# EAGLE design EEG_cap_v3 (EAGLE 9.6.2)

## Sheet 1 of 4
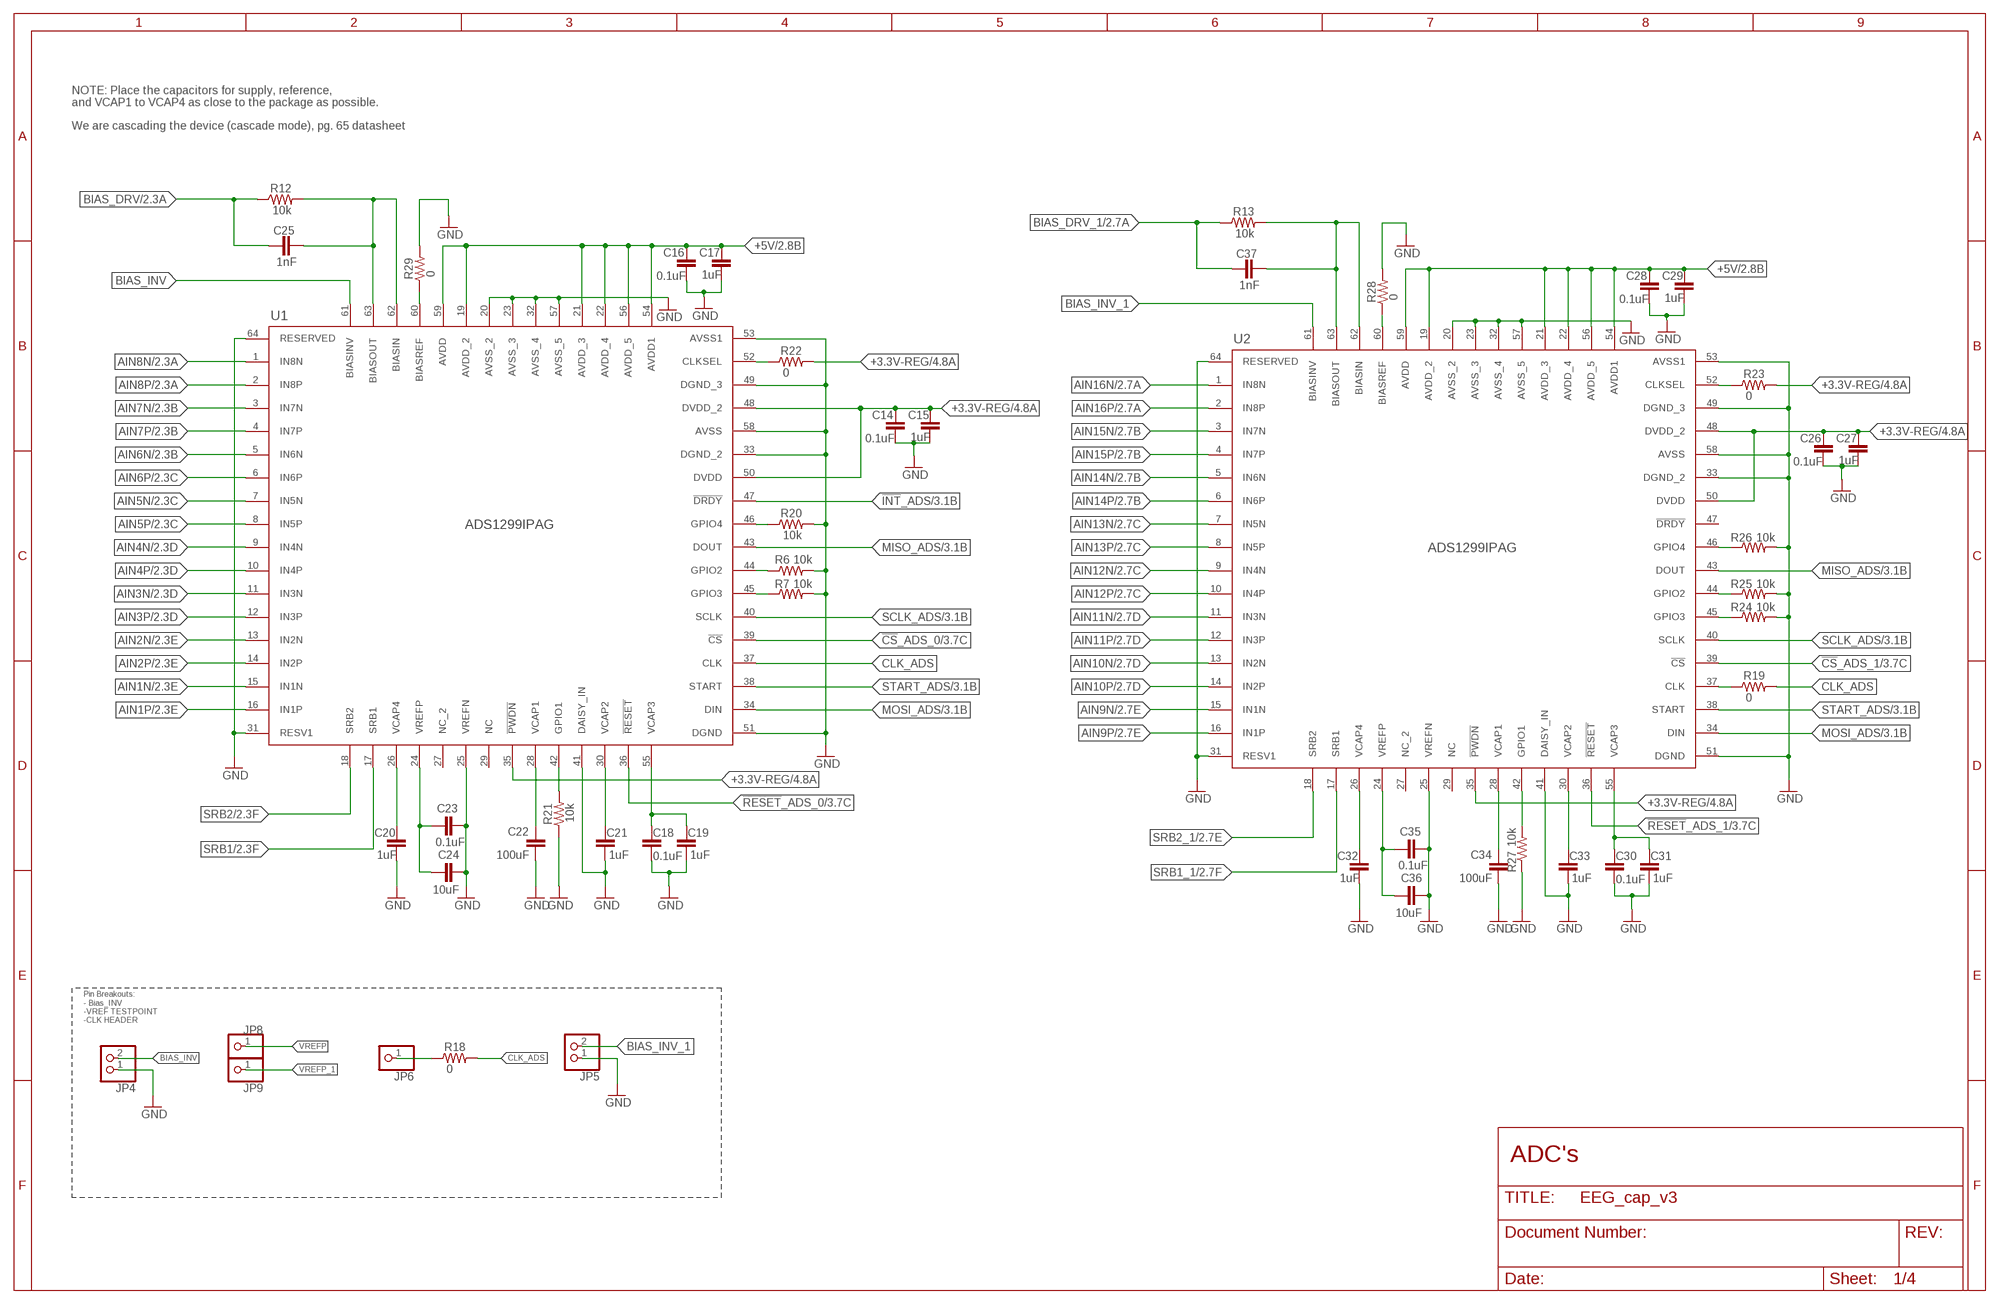
[diagram p0: schematic, sheet 1]

### Parts
C14  0.1uF  C-EUC0603  [C0603]
C15  1uF  C-EUC0603  [C0603]
C16  0.1uF  C-EUC0603  [C0603]
C17  1uF  C-EUC0603  [C0603]
C18  0.1uF  C-EUC0603  [C0603]
C19  1uF  C-EUC0603  [C0603]
C20  1uF  C-EUC0603  [C0603]
C21  1uF  C-EUC0603  [C0603]
C22  100uF  C-EUC1210  [C1210]
C23  0.1uF  C-EUC0603  [C0603]
C24  10uF  C-EUC0805  [C0805]
C25  1nF  C-EUC0603  [C0603]
C26  0.1uF  C-EUC0603  [C0603]
C27  1uF  C-EUC0603  [C0603]
C28  0.1uF  C-EUC0603  [C0603]
C29  1uF  C-EUC0603  [C0603]
C30  0.1uF  C-EUC0603  [C0603]
C31  1uF  C-EUC0603  [C0603]
C32  1uF  C-EUC0603  [C0603]
C33  1uF  C-EUC0603  [C0603]
C34  100uF  C-EUC1210  [C1210]
C35  0.1uF  C-EUC0603  [C0603]
C36  10uF  C-EUC0805  [C0805]
C37  1nF  C-EUC0603  [C0603]
JP4  PINHD-1X2  [1X02]
JP5  PINHD-1X2  [1X02]
JP6  PINHD-1X1  [1X01]
JP8  PINHD-1X1  [1X01]
JP9  PINHD-1X1  [1X01]
R6  10k  R-US_R0805  [R0805]
R7  10k  R-US_R0805  [R0805]
R12  10k  R-US_R0805  [R0805]
R13  10k  R-US_R0805  [R0805]
R18  0  R-US_R0805  [R0805]
R19  0  R-US_R0805  [R0805]
R20  10k  R-US_R0805  [R0805]
R21  10k  R-US_R0805  [R0805]
R22  0  R-US_R0805  [R0805]
R23  0  R-US_R0805  [R0805]
R24  10k  R-US_R0805  [R0805]
R25  10k  R-US_R0805  [R0805]
R26  10k  R-US_R0805  [R0805]
R27  10k  R-US_R0805  [R0805]
R28  0  R-US_R0805  [R0805]
R29  0  R-US_R0805  [R0805]
U1  ADS1299IPAG  [PAG64_TEX]
U2  ADS1299IPAG  [PAG64_TEX]

### Nets
!CS!_ADS_0: U1.39(!CS) ; also sheet 3
!CS!_ADS_1: U2.39(!CS) ; also sheet 3
!INT!_ADS: U1.47(!DRDY) ; also sheet 3
!RESET!_ADS_0: U1.36(!RESET) ; also sheet 3
!RESET!_ADS_1: U2.36(!RESET) ; also sheet 3
+3.3V-REG: C14.1 C15.1 C26.1 C27.1 R22.2 R23.2 U1.35(!PWDN) U1.48(DVDD_2) U1.50(DVDD) U2.35(!PWDN) U2.48(DVDD_2) U2.50(DVDD) ; also sheet 4
+5V: C16.1 C17.1 C28.1 C29.1 U1.19(AVDD_2) U1.21(AVDD_3) U1.22(AVDD_4) U1.54(AVDD1) U1.56(AVDD_5) U1.59(AVDD) U2.19(AVDD_2) U2.21(AVDD_3) U2.22(AVDD_4) U2.54(AVDD1) U2.56(AVDD_5) U2.59(AVDD) ; also sheet 2,3,4
AIN1N: U1.15(IN1N) ; also sheet 2
AIN1P: U1.16(IN1P) ; also sheet 2
AIN2N: U1.13(IN2N) ; also sheet 2
AIN2P: U1.14(IN2P) ; also sheet 2
AIN3N: U1.11(IN3N) ; also sheet 2
AIN3P: U1.12(IN3P) ; also sheet 2
AIN4N: U1.9(IN4N) ; also sheet 2
AIN4P: U1.10(IN4P) ; also sheet 2
AIN5N: U1.7(IN5N) ; also sheet 2
AIN5P: U1.8(IN5P) ; also sheet 2
AIN6N: U1.5(IN6N) ; also sheet 2
AIN6P: U1.6(IN6P) ; also sheet 2
AIN7N: U1.3(IN7N) ; also sheet 2
AIN7P: U1.4(IN7P) ; also sheet 2
AIN8N: U1.1(IN8N) ; also sheet 2
AIN8P: U1.2(IN8P) ; also sheet 2
AIN9N: U2.15(IN1N) ; also sheet 2
AIN9P: U2.16(IN1P) ; also sheet 2
AIN10N: U2.13(IN2N) ; also sheet 2
AIN10P: U2.14(IN2P) ; also sheet 2
AIN11N: U2.11(IN3N) ; also sheet 2
AIN11P: U2.12(IN3P) ; also sheet 2
AIN12N: U2.9(IN4N) ; also sheet 2
AIN12P: U2.10(IN4P) ; also sheet 2
AIN13N: U2.7(IN5N) ; also sheet 2
AIN13P: U2.8(IN5P) ; also sheet 2
AIN14N: U2.5(IN6N) ; also sheet 2
AIN14P: U2.6(IN6P) ; also sheet 2
AIN15N: U2.3(IN7N) ; also sheet 2
AIN15P: U2.4(IN7P) ; also sheet 2
AIN16N: U2.1(IN8N) ; also sheet 2
AIN16P: U2.2(IN8P) ; also sheet 2
BIAS1_IN: C37.2 R13.2 U2.62(BIASIN) U2.63(BIASOUT)
BIAS_DRV: C25.1 R12.1 ; also sheet 2
BIAS_DRV_1: C37.1 R13.1 ; also sheet 2
BIAS_IN: C25.2 R12.2 U1.62(BIASIN) U1.63(BIASOUT)
BIAS_INV: JP4.2 U1.61(BIASINV)
BIAS_INV_1: JP5.2 U2.61(BIASINV)
BIAS_REF: R29.1 U1.60(BIASREF)
BIAS_REF_1: R28.1 U2.60(BIASREF)
CLK: R19.1 U2.37(CLK)
CLK_ADS: R18.2 R19.2 U1.37(CLK)
CLK_HDR: JP6.1 R18.1
CLKSEL_0: R22.1 U1.52(CLKSEL)
CLKSEL_1: R23.1 U2.52(CLKSEL)
GND: C14.2 C15.2 C16.2 C17.2 C18.2 C19.2 C20.2 C21.2 C22.2 C23.2 C24.2 C26.2 C27.2 C28.2 C29.2 C30.2 C31.2 C32.2 C33.2 C34.2 C35.2 C36.2 JP4.1 JP5.1 R6.2 R7.2 R20.2 R21.1 R24.2 R25.2 R26.2 R27.1 R28.2 R29.2 U1.20(AVSS_2) U1.23(AVSS_3) U1.25(VREFN) U1.31(RESV1) U1.32(AVSS_4) U1.33(DGND_2) U1.41(DAISY_IN) U1.49(DGND_3) U1.51(DGND) U1.53(AVSS1) U1.57(AVSS_5) U1.58(AVSS) U1.64(RESERVED) U2.20(AVSS_2) U2.23(AVSS_3) U2.25(VREFN) U2.31(RESV1) U2.32(AVSS_4) U2.33(DGND_2) U2.41(DAISY_IN) U2.49(DGND_3) U2.51(DGND) U2.53(AVSS1) U2.57(AVSS_5) U2.58(AVSS) U2.64(RESERVED) ; also sheet 2,3,4
MISO_ADS: U1.43(DOUT) U2.43(DOUT) ; also sheet 3
MOSI_ADS: U1.34(DIN) U2.34(DIN) ; also sheet 3
N$1: R21.2 U1.42(GPIO1)
N$2: R7.1 U1.45(GPIO3)
N$3: R6.1 U1.44(GPIO2)
N$4: R20.1 U1.46(GPIO4)
N$5: R24.1 U2.45(GPIO3)
N$6: R25.1 U2.44(GPIO2)
N$7: R26.1 U2.46(GPIO4)
N$8: R27.2 U2.42(GPIO1)
SCLK_ADS: U1.40(SCLK) U2.40(SCLK) ; also sheet 3
SRB1: U1.17(SRB1) ; also sheet 2
SRB1_1: U2.17(SRB1) ; also sheet 2
SRB2: U1.18(SRB2) ; also sheet 2
SRB2_1: U2.18(SRB2) ; also sheet 2
START_ADS: U1.38(START) U2.38(START) ; also sheet 3
VCAP1: C22.1 U1.28(VCAP1)
VCAP1_1: C34.1 U2.28(VCAP1)
VCAP2: C21.1 U1.30(VCAP2)
VCAP2_1: C33.1 U2.30(VCAP2)
VCAP3: C18.1 C19.1 U1.55(VCAP3)
VCAP3_1: C30.1 C31.1 U2.55(VCAP3)
VCAP4: C20.1 U1.26(VCAP4)
VCAP6: C32.1 U2.26(VCAP4)
VREFP: C23.1 C24.1 JP8.1 U1.24(VREFP)
VREFP_1: C35.1 C36.1 JP9.1 U2.24(VREFP)
Unconnected: U1.27(NC_2) U1.29(NC) U2.27(NC_2) U2.29(NC) U2.47(!DRDY)

### Notes on the sheet
- NOTE: Place the capacitors for supply, reference,
  and VCAP1 to VCAP4 as close to the package as possible.
- We are cascading the device (cascade mode), pg. 65 datasheet
- Pin Breakouts: 
  - Bias_INV
  -VREF TESTPOINT
  -CLK HEADER
- ADC's

## Sheet 2 of 4
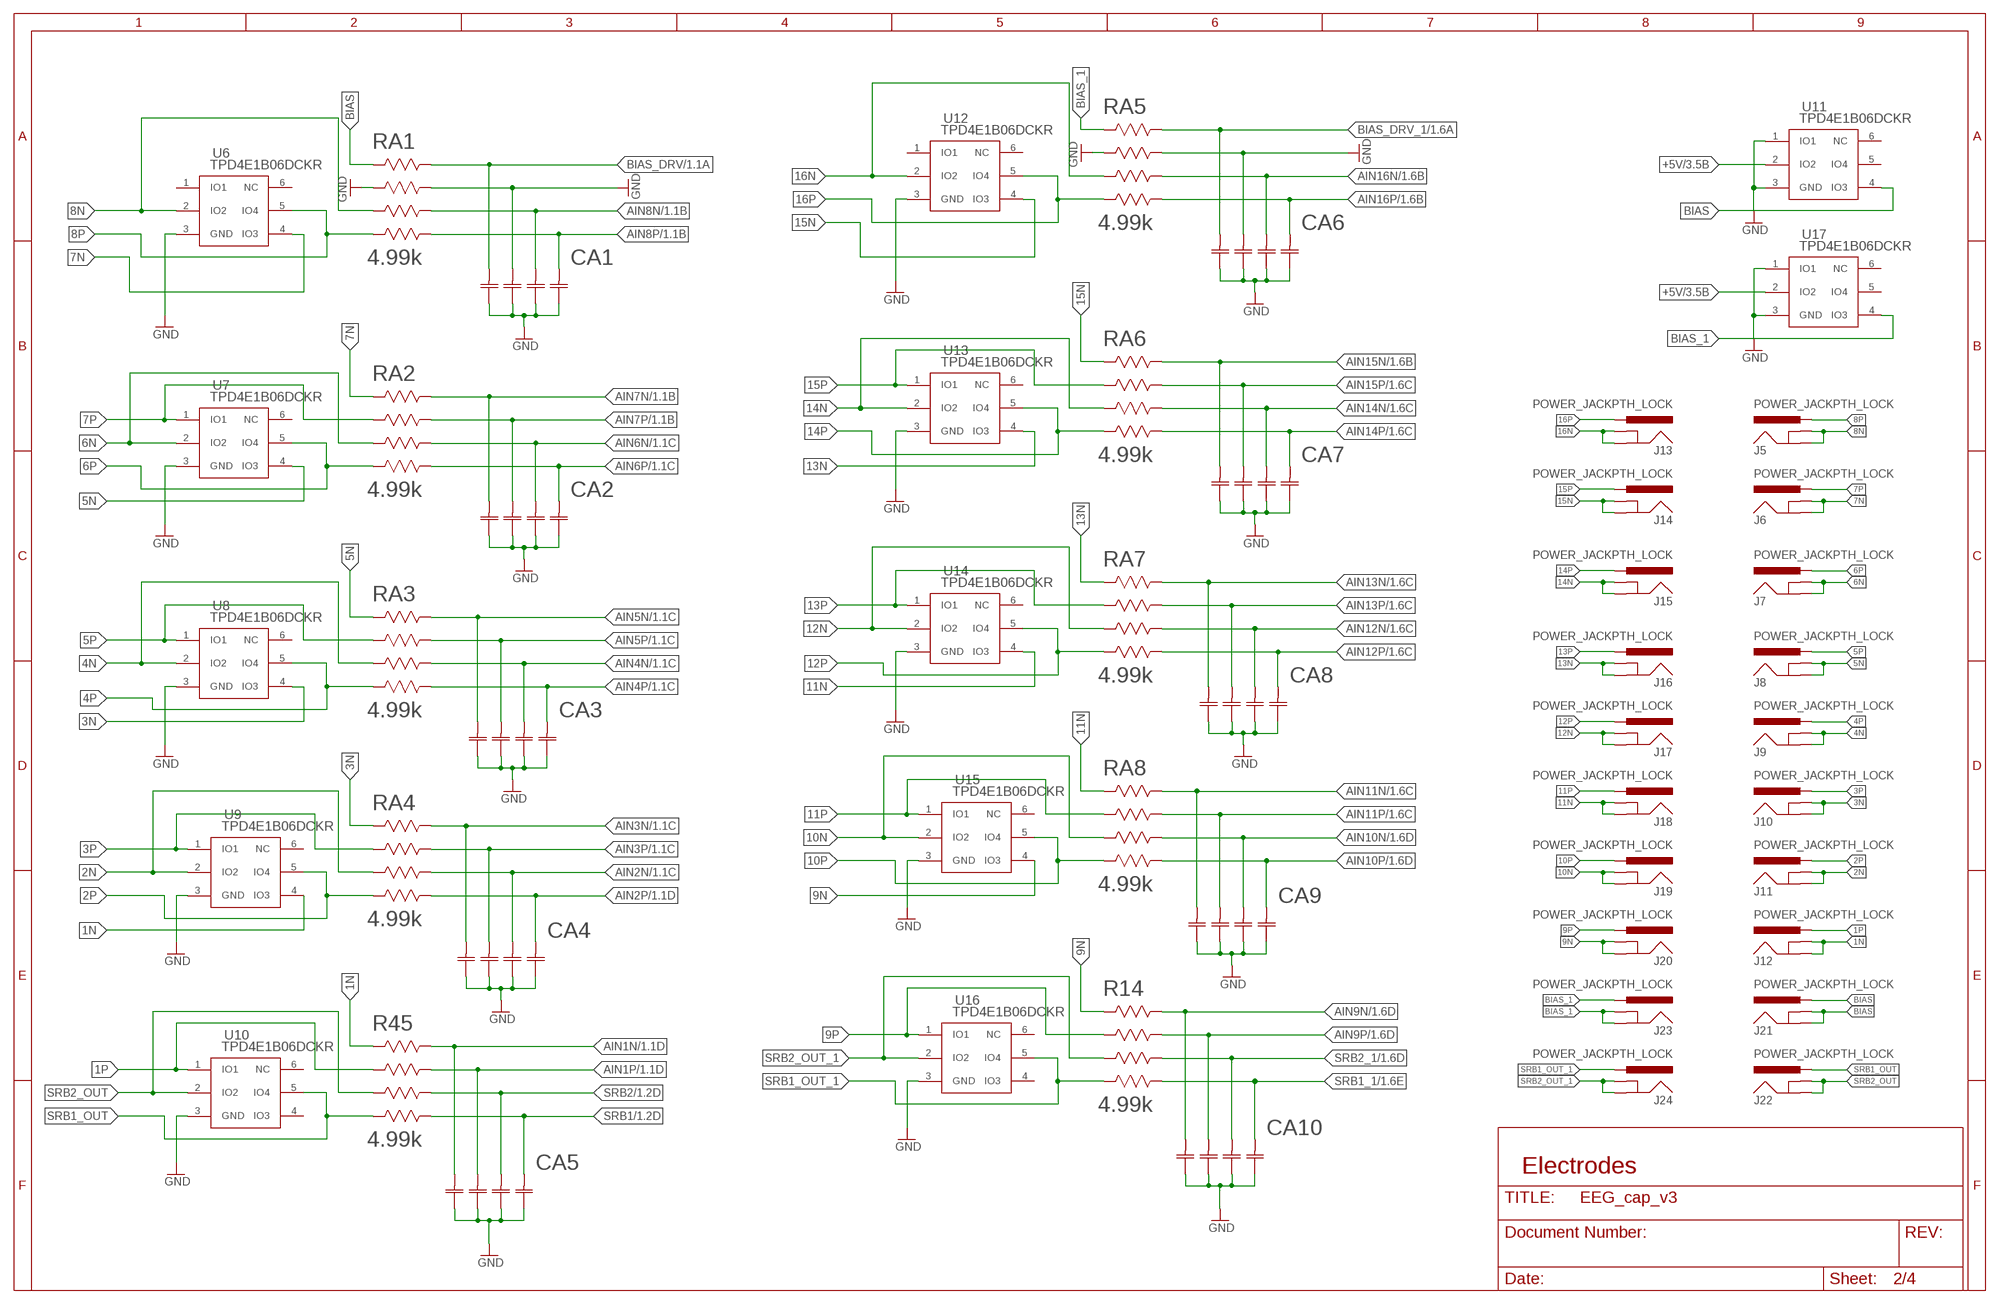
[diagram p1: schematic, sheet 2]

### Parts
CA1  4.7nF  CAP_ARRAY  [CAP_CA0612_3P2X1P6_YAG]
CA2  4.7nF  CAP_ARRAY  [CAP_CA0612_3P2X1P6_YAG]
CA3  4.7nF  CAP_ARRAY  [CAP_CA0612_3P2X1P6_YAG]
CA4  4.7nF  CAP_ARRAY  [CAP_CA0612_3P2X1P6_YAG]
CA5  4.7nF  CAP_ARRAY  [CAP_CA0612_3P2X1P6_YAG]
CA6  4.7nF  CAP_ARRAY  [CAP_CA0612_3P2X1P6_YAG]
CA7  4.7nF  CAP_ARRAY  [CAP_CA0612_3P2X1P6_YAG]
CA8  4.7nF  CAP_ARRAY  [CAP_CA0612_3P2X1P6_YAG]
CA9  4.7nF  CAP_ARRAY  [CAP_CA0612_3P2X1P6_YAG]
CA10  4.7nF  CAP_ARRAY  [CAP_CA0612_3P2X1P6_YAG]
J5  POWER_JACKPTH_LOCK  [POWER_JACK_PTH_LOCK]
J6  POWER_JACKPTH_LOCK  [POWER_JACK_PTH_LOCK]
J7  POWER_JACKPTH_LOCK  [POWER_JACK_PTH_LOCK]
J8  POWER_JACKPTH_LOCK  [POWER_JACK_PTH_LOCK]
J9  POWER_JACKPTH_LOCK  [POWER_JACK_PTH_LOCK]
J10  POWER_JACKPTH_LOCK  [POWER_JACK_PTH_LOCK]
J11  POWER_JACKPTH_LOCK  [POWER_JACK_PTH_LOCK]
J12  POWER_JACKPTH_LOCK  [POWER_JACK_PTH_LOCK]
J13  POWER_JACKPTH_LOCK  [POWER_JACK_PTH_LOCK]
J14  POWER_JACKPTH_LOCK  [POWER_JACK_PTH_LOCK]
J15  POWER_JACKPTH_LOCK  [POWER_JACK_PTH_LOCK]
J16  POWER_JACKPTH_LOCK  [POWER_JACK_PTH_LOCK]
J17  POWER_JACKPTH_LOCK  [POWER_JACK_PTH_LOCK]
J18  POWER_JACKPTH_LOCK  [POWER_JACK_PTH_LOCK]
J19  POWER_JACKPTH_LOCK  [POWER_JACK_PTH_LOCK]
J20  POWER_JACKPTH_LOCK  [POWER_JACK_PTH_LOCK]
J21  POWER_JACKPTH_LOCK  [POWER_JACK_PTH_LOCK]
J22  POWER_JACKPTH_LOCK  [POWER_JACK_PTH_LOCK]
J23  POWER_JACKPTH_LOCK  [POWER_JACK_PTH_LOCK]
J24  POWER_JACKPTH_LOCK  [POWER_JACK_PTH_LOCK]
R14  4.99k  CAT16-220J4LF  [BO_CAT16]
R45  4.99k  CAT16-220J4LF  [BO_CAT16]
RA1  4.99k  CAT16-220J4LF  [BO_CAT16]
RA2  4.99k  CAT16-220J4LF  [BO_CAT16]
RA3  4.99k  CAT16-220J4LF  [BO_CAT16]
RA4  4.99k  CAT16-220J4LF  [BO_CAT16]
RA5  4.99k  CAT16-220J4LF  [BO_CAT16]
RA6  4.99k  CAT16-220J4LF  [BO_CAT16]
RA7  4.99k  CAT16-220J4LF  [BO_CAT16]
RA8  4.99k  CAT16-220J4LF  [BO_CAT16]
U6  TPD4E1B06DCKR  [DCK6_TEX]
U7  TPD4E1B06DCKR  [DCK6_TEX]
U8  TPD4E1B06DCKR  [DCK6_TEX]
U9  TPD4E1B06DCKR  [DCK6_TEX]
U10  TPD4E1B06DCKR  [DCK6_TEX]
U11  TPD4E1B06DCKR  [DCK6_TEX]
U12  TPD4E1B06DCKR  [DCK6_TEX]
U13  TPD4E1B06DCKR  [DCK6_TEX]
U14  TPD4E1B06DCKR  [DCK6_TEX]
U15  TPD4E1B06DCKR  [DCK6_TEX]
U16  TPD4E1B06DCKR  [DCK6_TEX]
U17  TPD4E1B06DCKR  [DCK6_TEX]

### Nets
1N: J12.GND J12.GNDBREAK R45.1 U9.4(IO3)
1P: J12.PWR R45.2 U10.1(IO1)
2N: J11.GND J11.GNDBREAK RA4.3 U9.2(IO2)
2P: J11.PWR RA4.4 U9.5(IO4)
3N: J10.GND J10.GNDBREAK RA4.1 U8.4(IO3)
3P: J10.PWR RA4.2 U9.1(IO1)
4N: J9.GND J9.GNDBREAK RA3.3 U8.2(IO2)
4P: J9.PWR RA3.4 U8.5(IO4)
5N: J8.GND J8.GNDBREAK RA3.1 U7.4(IO3)
5P: J8.PWR RA3.2 U8.1(IO1)
6N: J7.GND J7.GNDBREAK RA2.3 U7.2(IO2)
6P: J7.PWR RA2.4 U7.5(IO4)
7N: J6.GND J6.GNDBREAK RA2.1 U6.4(IO3)
7P: J6.PWR RA2.2 U7.1(IO1)
8N: J5.GND J5.GNDBREAK RA1.3 U6.2(IO2)
8P: J5.PWR RA1.4 U6.5(IO4)
9N: J20.GND J20.GNDBREAK R14.1 U15.4(IO3)
9P: J20.PWR R14.2 U16.1(IO1)
10N: J19.GND J19.GNDBREAK RA8.3 U15.2(IO2)
10P: J19.PWR RA8.4 U15.5(IO4)
11N: J18.GND J18.GNDBREAK RA8.1 U14.4(IO3)
11P: J18.PWR RA8.2 U15.1(IO1)
12N: J17.GND J17.GNDBREAK RA7.3 U14.2(IO2)
12P: J17.PWR RA7.4 U14.5(IO4)
13N: J16.GND J16.GNDBREAK RA7.1 U13.4(IO3)
13P: J16.PWR RA7.2 U14.1(IO1)
14N: J15.GND J15.GNDBREAK RA6.3 U13.2(IO2)
14P: J15.PWR RA6.4 U13.5(IO4)
15N: J14.GND J14.GNDBREAK RA6.1 U12.4(IO3)
15P: J14.PWR RA6.2 U13.1(IO1)
16N: J13.GND J13.GNDBREAK RA5.3 U12.2(IO2)
16P: J13.PWR RA5.4 U12.5(IO4)
+5V: U11.2(IO2) U17.2(IO2) ; also sheet 1,3,4
AIN1N: CA5.8 R45.8 ; also sheet 1
AIN1P: CA5.7 R45.7 ; also sheet 1
AIN2N: CA4.6 RA4.6 ; also sheet 1
AIN2P: CA4.5 RA4.5 ; also sheet 1
AIN3N: CA4.8 RA4.8 ; also sheet 1
AIN3P: CA4.7 RA4.7 ; also sheet 1
AIN4N: CA3.6 RA3.6 ; also sheet 1
AIN4P: CA3.5 RA3.5 ; also sheet 1
AIN5N: CA3.8 RA3.8 ; also sheet 1
AIN5P: CA3.7 RA3.7 ; also sheet 1
AIN6N: CA2.6 RA2.6 ; also sheet 1
AIN6P: CA2.5 RA2.5 ; also sheet 1
AIN7N: CA2.8 RA2.8 ; also sheet 1
AIN7P: CA2.7 RA2.7 ; also sheet 1
AIN8N: CA1.6 RA1.6 ; also sheet 1
AIN8P: CA1.5 RA1.5 ; also sheet 1
AIN9N: CA10.8 R14.8 ; also sheet 1
AIN9P: CA10.7 R14.7 ; also sheet 1
AIN10N: CA9.6 RA8.6 ; also sheet 1
AIN10P: CA9.5 RA8.5 ; also sheet 1
AIN11N: CA9.8 RA8.8 ; also sheet 1
AIN11P: CA9.7 RA8.7 ; also sheet 1
AIN12N: CA8.6 RA7.6 ; also sheet 1
AIN12P: CA8.5 RA7.5 ; also sheet 1
AIN13N: CA8.8 RA7.8 ; also sheet 1
AIN13P: CA8.7 RA7.7 ; also sheet 1
AIN14N: CA7.6 RA6.6 ; also sheet 1
AIN14P: CA7.5 RA6.5 ; also sheet 1
AIN15N: CA7.8 RA6.8 ; also sheet 1
AIN15P: CA7.7 RA6.7 ; also sheet 1
AIN16N: CA6.6 RA5.6 ; also sheet 1
AIN16P: CA6.5 RA5.5 ; also sheet 1
BIAS: J21.GND J21.GNDBREAK J21.PWR RA1.1 U11.4(IO3)
BIAS_1: J23.GND J23.GNDBREAK J23.PWR RA5.1 U17.4(IO3)
BIAS_DRV: CA1.8 RA1.8 ; also sheet 1
BIAS_DRV_1: CA6.8 RA5.8 ; also sheet 1
GND: CA1.1 CA1.2 CA1.3 CA1.4 CA1.7 CA2.1 CA2.2 CA2.3 CA2.4 CA3.1 CA3.2 CA3.3 CA3.4 CA4.1 CA4.2 CA4.3 CA4.4 CA5.1 CA5.2 CA5.3 CA5.4 CA6.1 CA6.2 CA6.3 CA6.4 CA6.7 CA7.1 CA7.2 CA7.3 CA7.4 CA8.1 CA8.2 CA8.3 CA8.4 CA9.1 CA9.2 CA9.3 CA9.4 CA10.1 CA10.2 CA10.3 CA10.4 RA1.2 RA1.7 RA5.2 RA5.7 U6.3(GND) U7.3(GND) U8.3(GND) U9.3(GND) U10.3(GND) U11.1(IO1) U11.3(GND) U12.3(GND) U13.3(GND) U14.3(GND) U15.3(GND) U16.3(GND) U17.1(IO1) U17.3(GND) ; also sheet 1,3,4
SRB1: CA5.5 R45.5 ; also sheet 1
SRB1_1: CA10.5 R14.5 ; also sheet 1
SRB1_OUT: J22.PWR R45.4 U10.5(IO4)
SRB1_OUT_1: J24.PWR R14.4 U16.5(IO4)
SRB2: CA5.6 R45.6 ; also sheet 1
SRB2_1: CA10.6 R14.6 ; also sheet 1
SRB2_OUT: J22.GND J22.GNDBREAK R45.3 U10.2(IO2)
SRB2_OUT_1: J24.GND J24.GNDBREAK R14.3 U16.2(IO2)
Unconnected: U6.1(IO1) U6.6(NC) U7.6(NC) U8.6(NC) U9.6(NC) U10.4(IO3) U10.6(NC) U11.5(IO4) U11.6(NC) U12.1(IO1) U12.6(NC) U13.6(NC) U14.6(NC) U15.6(NC) U16.4(IO3) U16.6(NC) U17.5(IO4) U17.6(NC)

### Notes on the sheet
- Electrodes

## Sheet 3 of 4
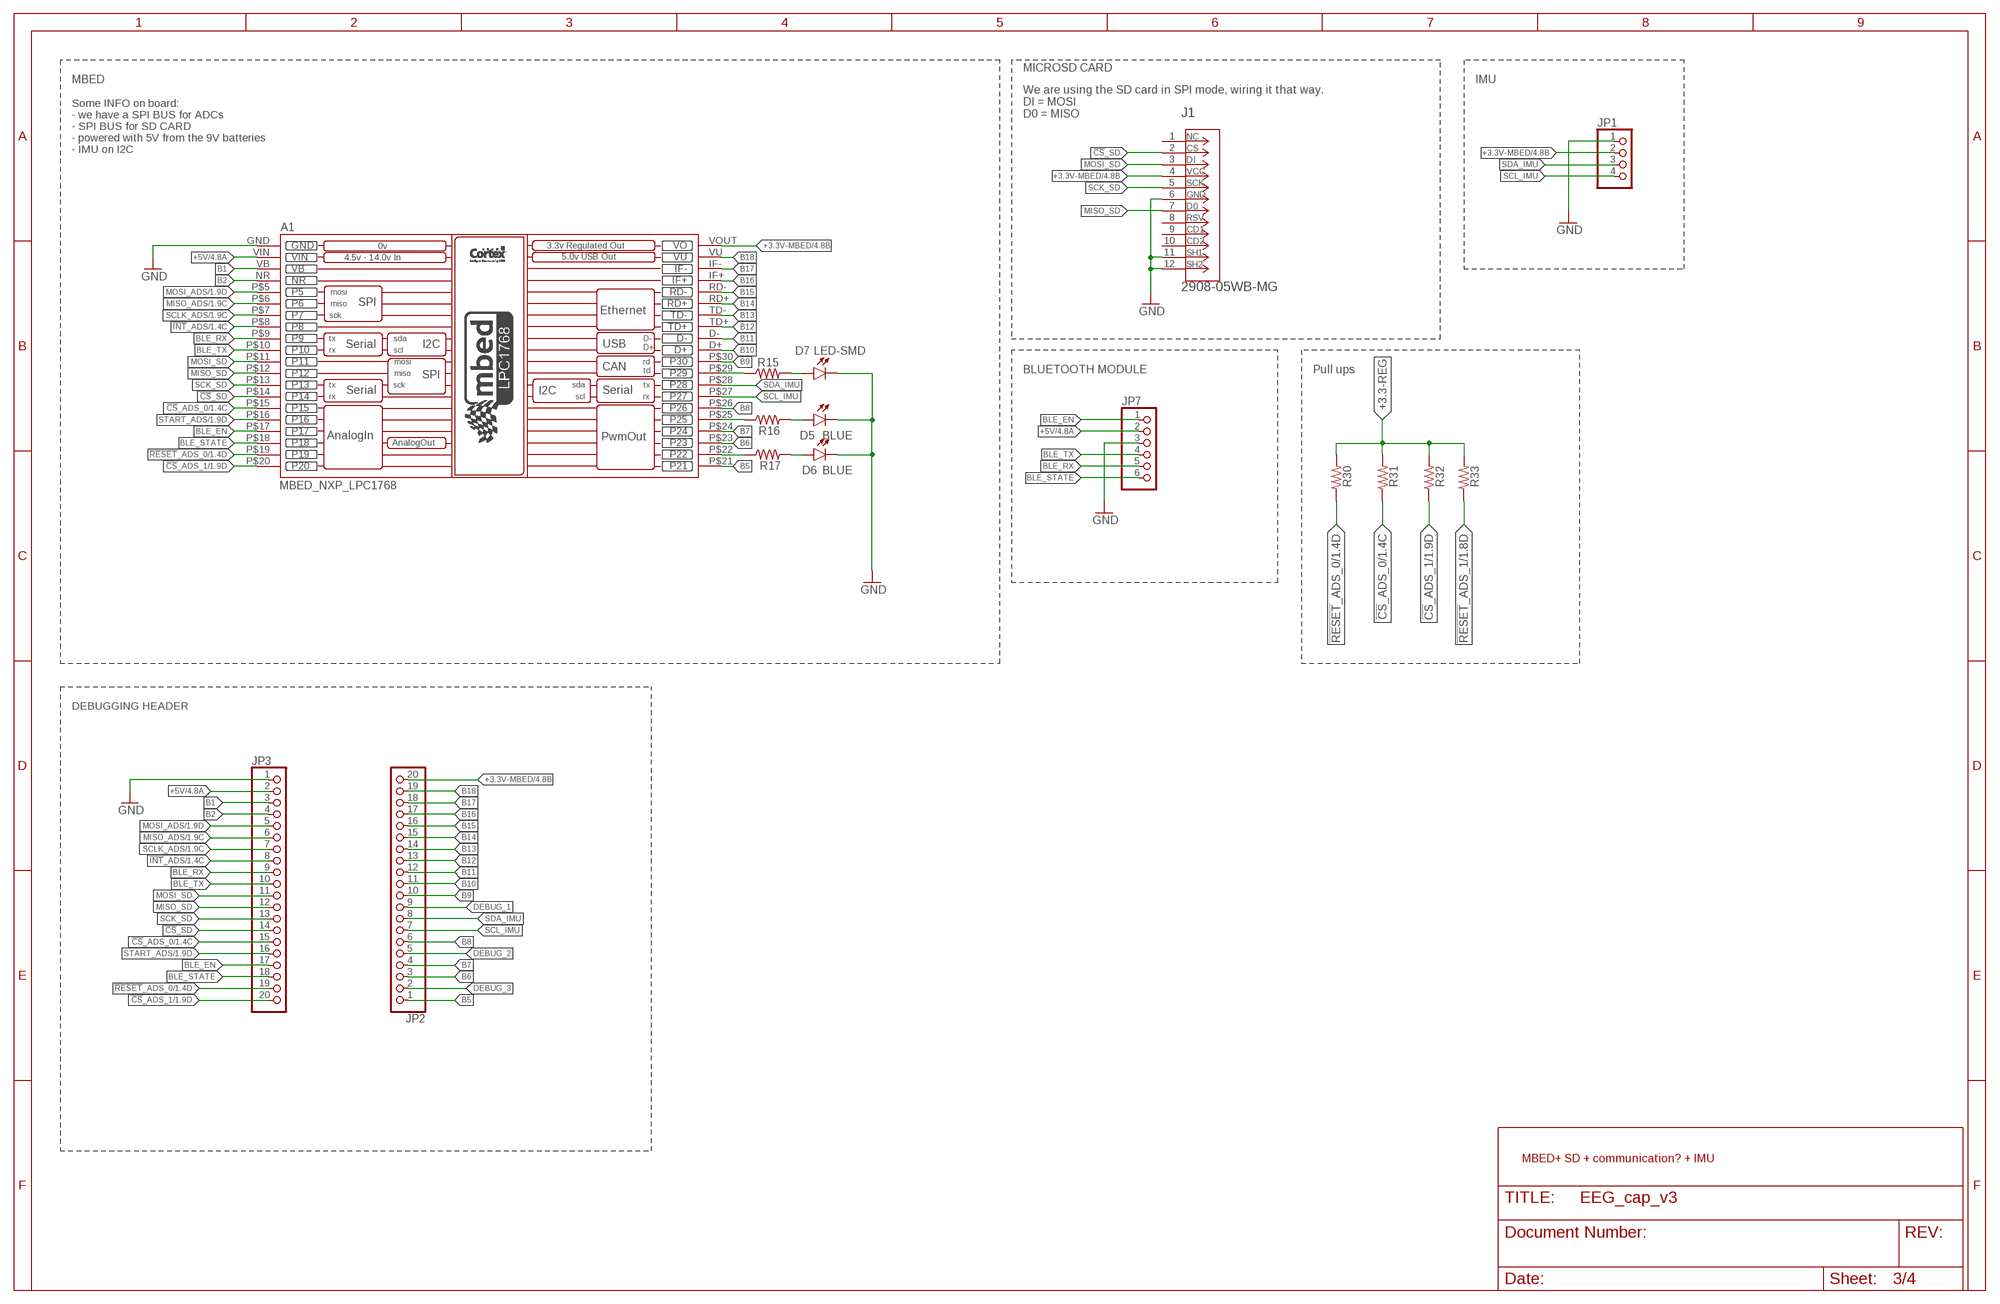
[diagram p2: schematic, sheet 3]

### Parts
A1  MBED_NXP_LPC1768  [MBED_LPC1768]
D5  BLUE  LED-SMD  [LED0603]
D6  BLUE  LED-SMD  [LED0603]
D7  LED-SMD  [LED0603]
J1  2908-05WB-MG  [CONN_3M_2900]
JP1  PINHD-1X4  [1X04]
JP2  PINHD-1X20  [1X20]
JP3  PINHD-1X20  [1X20]
JP7  PINHD-1X6  [1X06]
R15  1K  R-US_R0805  [R0805]
R16  1k  R-US_R0805  [R0805]
R17  1k  R-US_R0805  [R0805]
R30  10k  R-US_R0805  [R0805]
R31  1k  R-US_R0805  [R0805]
R32  1k  R-US_R0805  [R0805]
R33  10k  R-US_R0805  [R0805]

### Nets
!CS!_ADS_0: A1.P$15(P15) JP3.15 R31.1 ; also sheet 1
!CS!_ADS_1: A1.P$20(P20) JP3.20 R32.1 ; also sheet 1
!CS!_SD: A1.P$14(P14) J1.2 JP3.14
!INT!_ADS: A1.P$8(P8) JP3.8 ; also sheet 1
!RESET!_ADS_0: A1.P$19(P19) JP3.19 R30.1 ; also sheet 1
!RESET!_ADS_1: R33.1 ; also sheet 1
+3.3-REG: R30.2 R31.2 R32.2 R33.2
+3.3V-MBED: A1.VOUT(VO) J1.4 JP1.2 JP2.20 ; also sheet 4
+5V: A1.VIN JP3.2 JP7.2 ; also sheet 1,2,4
B1: A1.VB JP3.3
B2: A1.NR JP3.4
B5: A1.P$21(P21) JP2.1
B6: A1.P$23(P23) JP2.3
B7: A1.P$24(P24) JP2.4
B8: A1.P$26(P26) JP2.6
B9: A1.P$30(P30) JP2.10
B10: A1.D+ JP2.11
B11: A1.D- JP2.12
B12: A1.TD+ JP2.13
B13: A1.TD- JP2.14
B14: A1.RD+ JP2.15
B15: A1.RD- JP2.16
B16: A1.IF+ JP2.17
B17: A1.IF- JP2.18
B18: A1.VU JP2.19
BLE_EN: A1.P$17(P17) JP3.17 JP7.1
BLE_RX: A1.P$9(P9) JP3.9 JP7.5
BLE_STATE: A1.P$18(P18) JP3.18 JP7.6
BLE_TX: A1.P$10(P10) JP3.10 JP7.4
DEBUG_1: A1.P$29(P29) JP2.9 R15.1
DEBUG_2: A1.P$25(P25) JP2.5 R16.1
DEBUG_3: A1.P$22(P22) JP2.2 R17.1
GND: A1.GND D5.C D6.C D7.C J1.6 J1.11 J1.12 JP1.1 JP3.1 JP7.3 ; also sheet 1,2,4
LED-1: D7.A R15.2
LED_2: D5.A R16.2
LED_3: D6.A R17.2
MISO_ADS: A1.P$6(P6) JP3.6 ; also sheet 1
MISO_SD: A1.P$12(P12) J1.7 JP3.12
MOSI_ADS: A1.P$5(P5) JP3.5 ; also sheet 1
MOSI_SD: A1.P$11(P11) J1.3 JP3.11
SCK_SD: A1.P$13(P13) J1.5 JP3.13
SCL_IMU: A1.P$27(P27) JP1.4 JP2.7
SCLK_ADS: A1.P$7(P7) JP3.7 ; also sheet 1
SDA_IMU: A1.P$28(P28) JP1.3 JP2.8
START_ADS: A1.P$16(P16) JP3.16 ; also sheet 1
Unconnected: J1.1 J1.8 J1.9 J1.10

### Notes on the sheet
- MICROSD CARD
- MBED | IMU
- We are using the SD card in SPI mode, wiring it that way. 
  DI = MOSI
  D0 = MISO
- Some INFO on board: 
  - we have a SPI BUS for ADCs 
  - SPI BUS for SD CARD
  - powered with 5V from the 9V batteries 
  - IMU on I2C
- BLUETOOTH MODULE | Pull ups
- DEBUGGING HEADER
- MBED+ SD + communication? + IMU

## Sheet 4 of 4
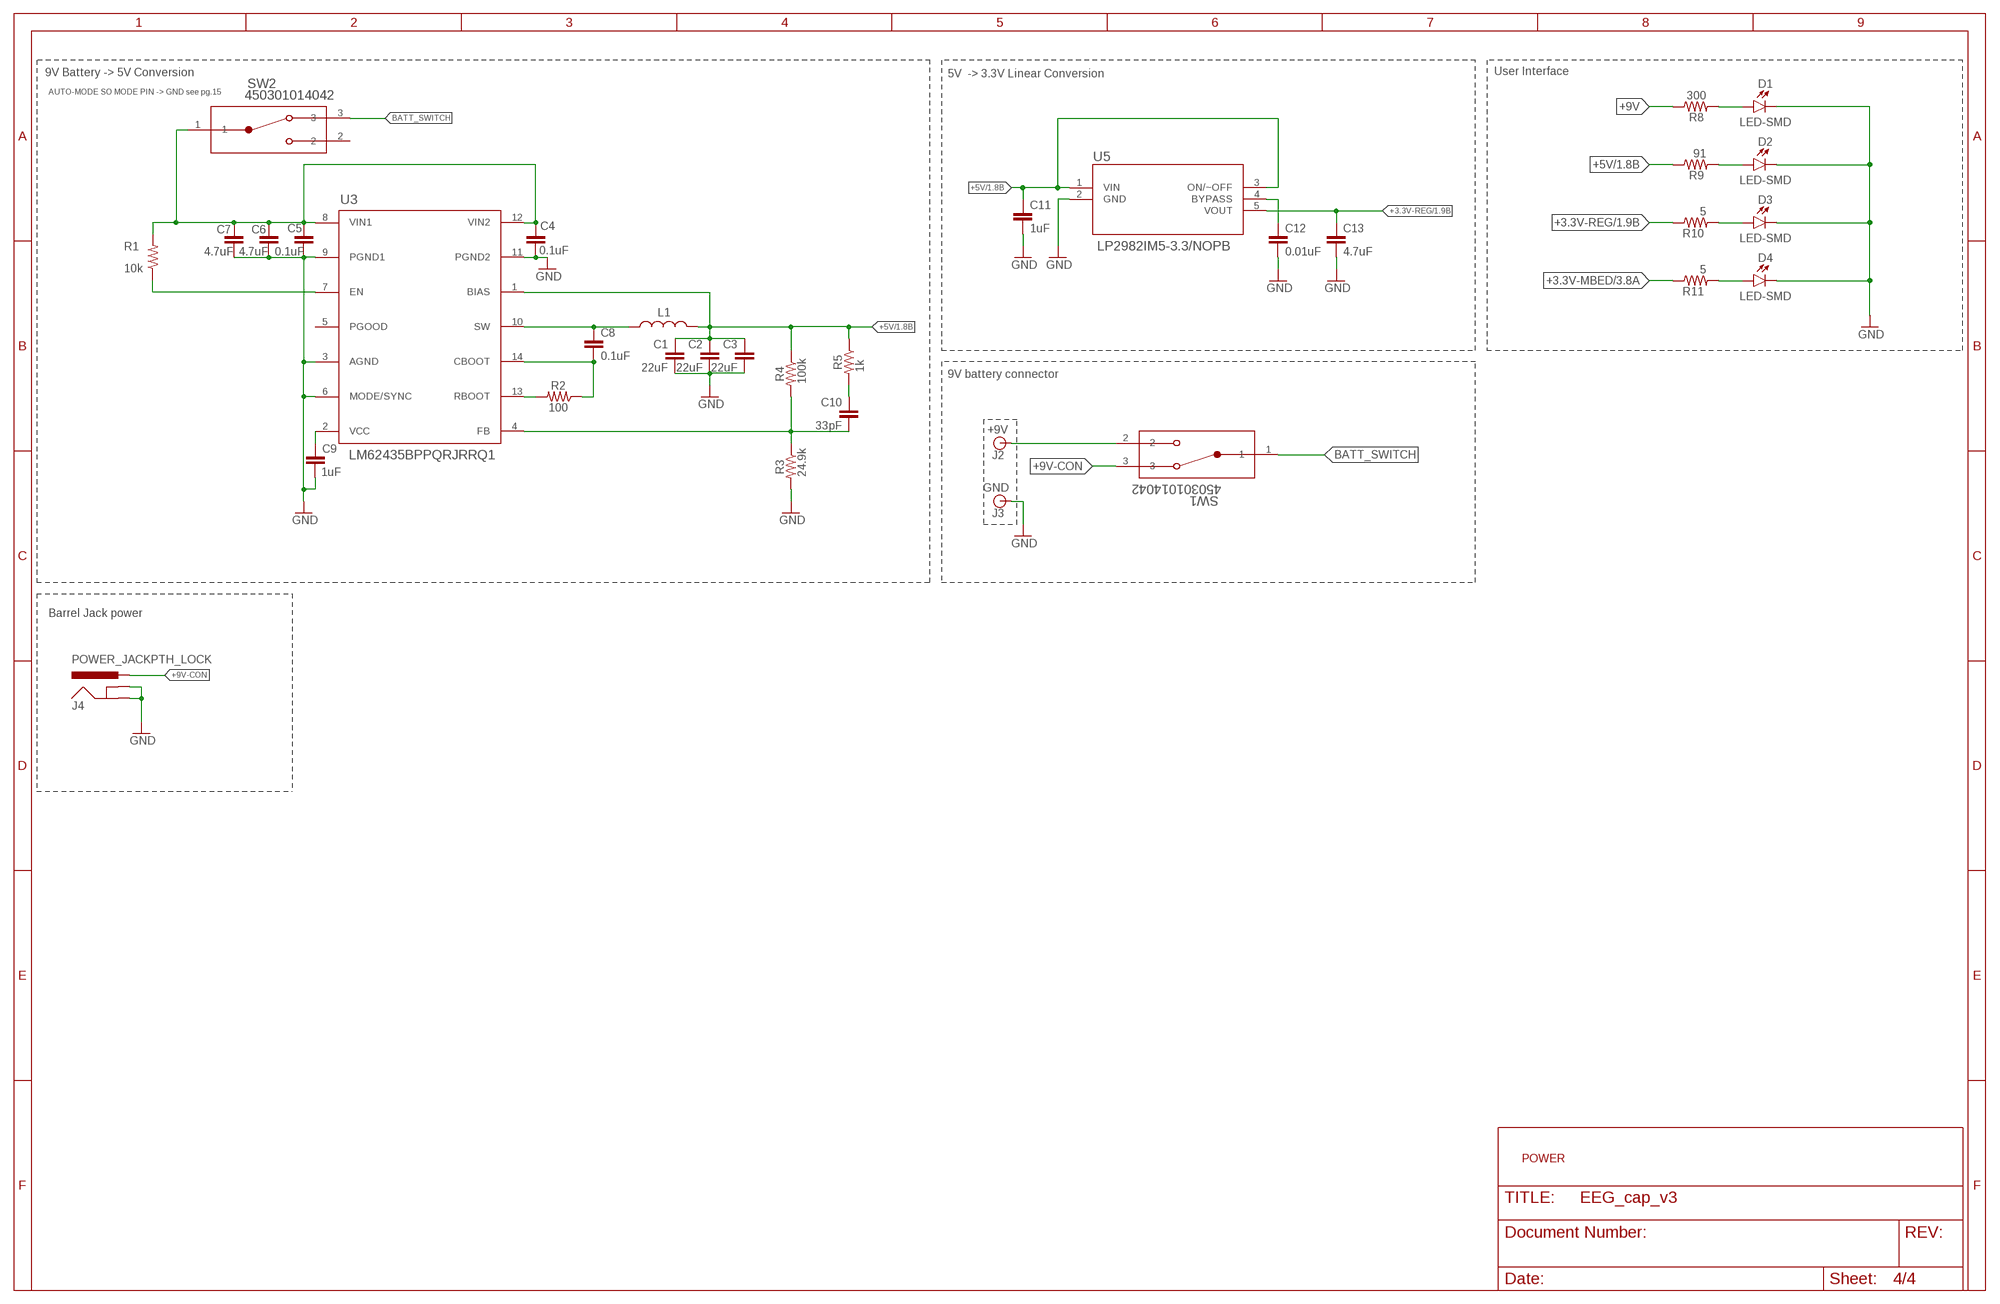
[diagram p3: schematic, sheet 4]

### Parts
C1  22uF  C-EUC0805  [C0805]
C2  22uF  C-EUC0805  [C0805]
C3  22uF  C-EUC0805  [C0805]
C4  0.1uF  C-EUC0805  [C0805]
C5  0.1uF  C-EUC0805  [C0805]
C6  4.7uF  C-EUC0805  [C0805]
C7  4.7uF  C-EUC0805  [C0805]
C8  0.1uF  C-EUC0805  [C0805]
C9  1uF  C-EUC0805  [C0805]
C10  33pF  C-EUC0805  [C0805]
C11  1uF  C-EUC0805  [C0805]
C12  0.01uF  C-EUC0805  [C0805]
C13  4.7uF  C-EUC0805  [C0805]
D1  LED-SMD  [LED0603]
D2  LED-SMD  [LED0603]
D3  LED-SMD  [LED0603]
D4  LED-SMD  [LED0603]
J2  +9V  BANANA_CONN  [BANANA_CONN]
J3  GND  BANANA_CONN  [BANANA_CONN]
J4  POWER_JACKPTH_LOCK  [POWER_JACK_PTH_LOCK]
L1  DFE252010P-1R5M=P2  [INDC2520X100N]
R1  10k  R-US_R0805  [R0805]
R2  100  R-US_R0805  [R0805]
R3  24.9k  R-US_R0805  [R0805]
R4  100k  R-US_R0805  [R0805]
R5  1k  R-US_R0805  [R0805]
R8  300  R-US_R0805  [R0805]
R9  91  R-US_R0805  [R0805]
R10  5  R-US_R0805  [R0805]
R11  5  R-US_R0805  [R0805]
SW1  450301014042  [SW_450301014042_WRE]
SW2  450301014042  [SW_450301014042_WRE]
U3  LM62435BPPQRJRRQ1  [VQFN-HR14_RJR_TEX]
U5  LP2982IM5-3.3/NOPB  [MF05A]

### Nets
3.3_ANA_LED: D3.A R10.2
3.3V_DIG_LED: D4.A R11.2
5V_LED: D2.A R9.2
9V_LED: D1.A R8.2
+3.3V-MBED: R11.1 ; also sheet 3
+3.3V-REG: C13.1 R10.1 U5.5(VOUT) ; also sheet 1
+5V: C1.1 C2.1 C3.1 C11.1 L1.2 R4.1 R5.1 R9.1 U3.1(BIAS) U5.1(VIN) U5.3(ON/~OFF) ; also sheet 1,2,3
+9V: C4.1 C5.1 C6.1 C7.1 R1.2 R8.1 SW2.1 U3.8(VIN1) U3.12(VIN2)
+9V-CON: J4.PWR SW1.3
+9V_BATT: J2.P$1 SW1.2
BATT_SWITCH: SW1.1 SW2.3
BYPASS: C12.1 U5.4(BYPASS)
CBOOT: C8.2 R2.1 U3.14(CBOOT)
EN: R1.1 U3.7(EN)
FB: C10.2 R3.1 R4.2 U3.4(FB)
FB_CAP: C10.1 R5.2
GND: C1.2 C2.2 C3.2 C4.2 C5.2 C6.2 C7.2 C9.2 C11.2 C12.2 C13.2 D1.C D2.C D3.C D4.C J3.P$1 J4.GND J4.GNDBREAK R3.2 U3.3(AGND) U3.6(MODE/SYNC) U3.9(PGND1) U3.11(PGND2) U5.2(GND) ; also sheet 1,2,3
RBOOT: R2.2 U3.13(RBOOT)
SW: C8.1 L1.1 U3.10(SW)
VCC_CHIP: C9.1 U3.2(VCC)
Unconnected: SW2.2 U3.5(PGOOD)

### Notes on the sheet
- 9V Battery -> 5V Conversion | 5V  -> 3.3V Linear Conversion | User Interface
- AUTO-MODE SO MODE PIN -> GND see pg.15
- 9V battery connector
- Barrel Jack power
- POWER

## Library data of the parts
A1 = RoboJackets-Boards:MBED_NXP_LPC1768: Mbed LPC1768 - ARM CORTEX v2.1 Website <https://os.mbed.com/platforms/mbed-LPC1768/>; DKPN: 568-4916-ND
C1-C37 = resistor:C-EU: CAPACITOR, European symbol
CA1-CA10 = ADC:CAP_ARRAY
D1-D7 = RoboJackets-LEDs:LED-SMD: Series of 0603 LEDs
J1 = ADC:2908-05WB-MG; COPYRIGHT: Copyright (C) 2021 Ultra Librarian. All rights reserved.; DIGI-KEY_PART_NUMBER_1: 3M5607TR-ND; DIGI-KEY_PART_NUMBER_2: 3M5607CT-ND; DIGI-KEY_PART_NUMBER_3: 3M5607DKR-ND; MANUFACTURER_PART_NUMBER: 2908-05WB-MG; MFR_NAME: 3M
J2 J3 = SparkFun-Connectors:BANANA_CONN: Through-hole Banana Jack Basic PTH connection for banana jack plugs SparkFun Products: Multimeter Kit <https://www.sparkfun.com/products/retired/10956> Banana to Alligator Cable <https://www.sparkfun.com/products/retired/509> Banana to Alligator Coax Cable <https://www.sparkfun.com/products/retired/508> Banana to Banana Cable <https://www.sparkfun.com/products/retired/507> Banana to IC Hook Cables <https://www.sparkfun.com/products/retired/506>
J4-J24 = SparkFun-Connectors:POWER_JACK: Power Jack Connector This is the standard 5.5mm barrel jack for power. The PTH is the most common, proven, reliable, footprint. The Slot footprint only works if the mill layer is transmitted to the PCB fab house so be warned. Here are the connectors we sell at SparkFun: DC Barrel Power Jack/Connector <https://www.sparkfun.com/products/119> (PRT-00119) DC Barrel Power Jack/Connector (SMD) <https://www.sparkfun.com/products/12748> (PRT-12748) DC Barrel Jack Adapter - Breadboard Compatible <https://www.sparkfun.com/products/10811> (PRT-10811) It is used on this SparkFun product (and many, many others): SparkFun RedBoard - Programmed with Arduino <https://www.sparkfun.com/products/12757> (DEV-12757) Also, if you need a mating power supply or connector, please check these out: Wall Adapter Power Supply - 9VDC 650mA <https://www.sparkfun.com/products/298> (TOL-00298) DC Barrel Jack Adapter - Male <https://www.sparkfun.com/products/10287> (PRT-10287); PROD_ID: CONN-08197; SF_ID: PRT-00119
JP1 = RoboJackets-Connectors:PINHD-1X4: PIN HEADER
JP2 JP3 = RoboJackets-Connectors:PINHD-1X20: PIN HEADER
JP4 JP5 = RoboJackets-Connectors:PINHD-1X2: PIN HEADER
JP6 JP8 JP9 = RoboJackets-Connectors:PINHD-1X1: PIN HEADER
JP7 = RoboJackets-Connectors:PINHD-1X6: PIN HEADER
L1 = ADC:DFE252010P-1R5M=P2: INDUCTOR, SHLD, 1.5UH, 20%, 2.5A, 1008; DESCRIPTION: Inductor with Inductance: 1.5uH Tol. +/-20%, Package: 1008 (2520); DIGI-KEY_PART_NUMBER: 490-10636-1-ND; MF: Murata; MP: DFE252010P-1R5M=P2; PACKAGE: 2520 Murata; PURCHASE-URL: https://pricing.snapeda.com/search/part/DFE252010P-1R5M=P2/?ref=eda
R1-R13 R15-R33 = resistor:R-US_: RESISTOR, American symbol
R14 R45 RA1-RA8 = ADC:CAT16-220J4LF; COPYRIGHT: Copyright (C) 2021 Ultra Librarian. All rights reserved.; MANUFACTURER_PART_NUMBER: CAT16-220J4LF; MFR_NAME: Bourns Electronics
SW1 SW2 = ADC:450301014042; COPYRIGHT: Copyright (C) 2021 Ultra Librarian. All rights reserved.; DIGI-KEY_PART_NUMBER_1: 450301014042-ND; MANUFACTURER_PART_NUMBER: 450301014042; MFR_NAME: Wurth Electronics
U1 U2 = ADC:ADS1299IPAG; COPYRIGHT: Copyright (C) 2021 Ultra Librarian. All rights reserved.; MANUFACTURER_PART_NUMBER: ADS1299IPAG; MFR_NAME: Texas Instruments
U3 = ADC:LM62435BPPQRJRRQ1; COPYRIGHT: Copyright (C) 2021 Ultra Librarian. All rights reserved.; DIGI-KEY_PART_NUMBER_1: 296-LM62435BPPQRJRRQ1TR-ND; MANUFACTURER_PART_NUMBER: LM62435BPPQRJRRQ1; MFR_NAME: Texas Instruments
U5 = ADC:LP2982IM5-3.3/NOPB; COPYRIGHT: Copyright (C) 2021 Ultra Librarian. All rights reserved.; DIGI-KEY_PART_NUMBER_1: 2156-LP2982IM5-3.3/NOPB-ND; DIGI-KEY_PART_NUMBER_2: 2156-LP2982IM5-3.3/NOPB-TI-ND; DIGI-KEY_PART_NUMBER_3: LP2982IM5-3.3/NOPBCT-ND; DIGI-KEY_PART_NUMBER_4: LP2982IM5-3.3/NOPBDKR-ND; DIGI-KEY_PART_NUMBER_5: LP2982IM5-3.3/NOPBTR-ND; MANUFACTURER_PART_NUMBER: LP2982IM5-3.3/NOPB; MFR_NAME: Texas Instruments; TYPE: LP2982AIM5-3.0
U6-U17 = ADC:TPD4E1B06DCKR; COPYRIGHT: Copyright (C) 2021 Ultra Librarian. All rights reserved.; DIGI-KEY_PART_NUMBER_1: 296-39346-1-ND; DIGI-KEY_PART_NUMBER_2: 296-39346-2-ND; DIGI-KEY_PART_NUMBER_3: 296-39346-6-ND; DIGI-KEY_PART_NUMBER_4: TPD4E1B06DCKR-ND; MANUFACTURER_PART_NUMBER: TPD4E1B06DCKR; MFR_NAME: Texas Instruments

## Board
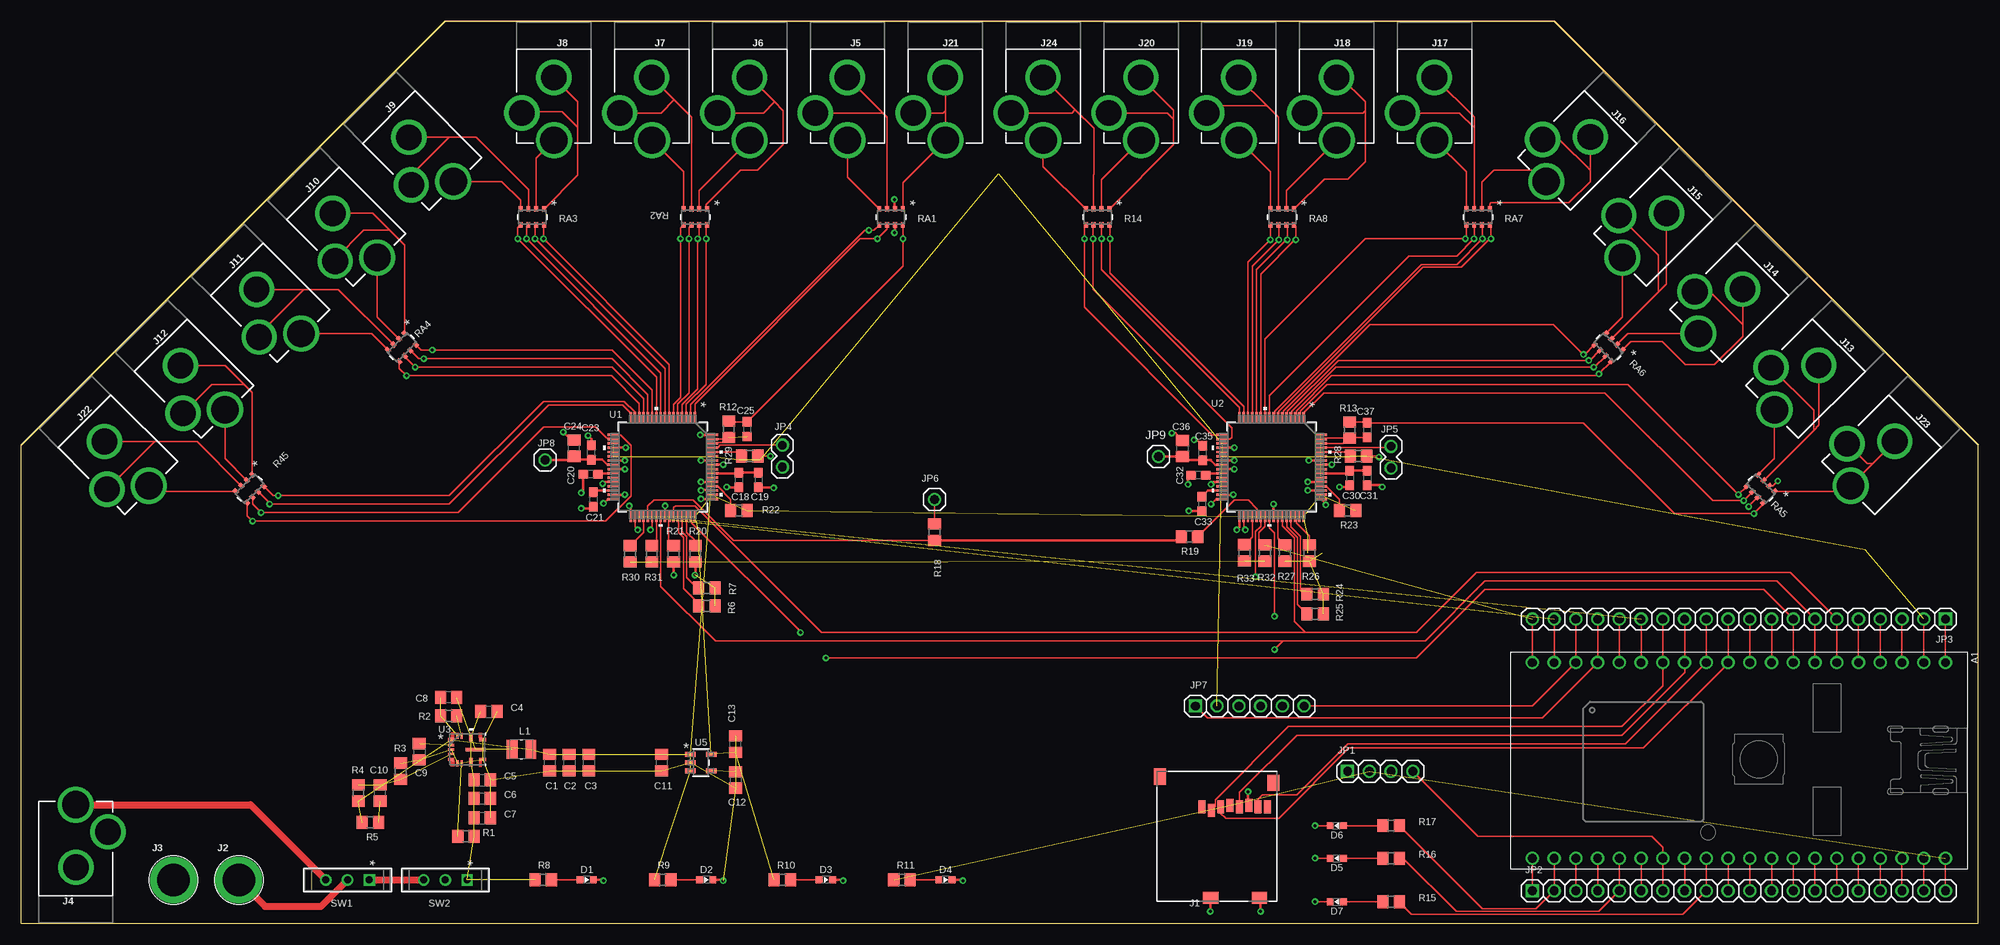
[diagram p4: board, top side]
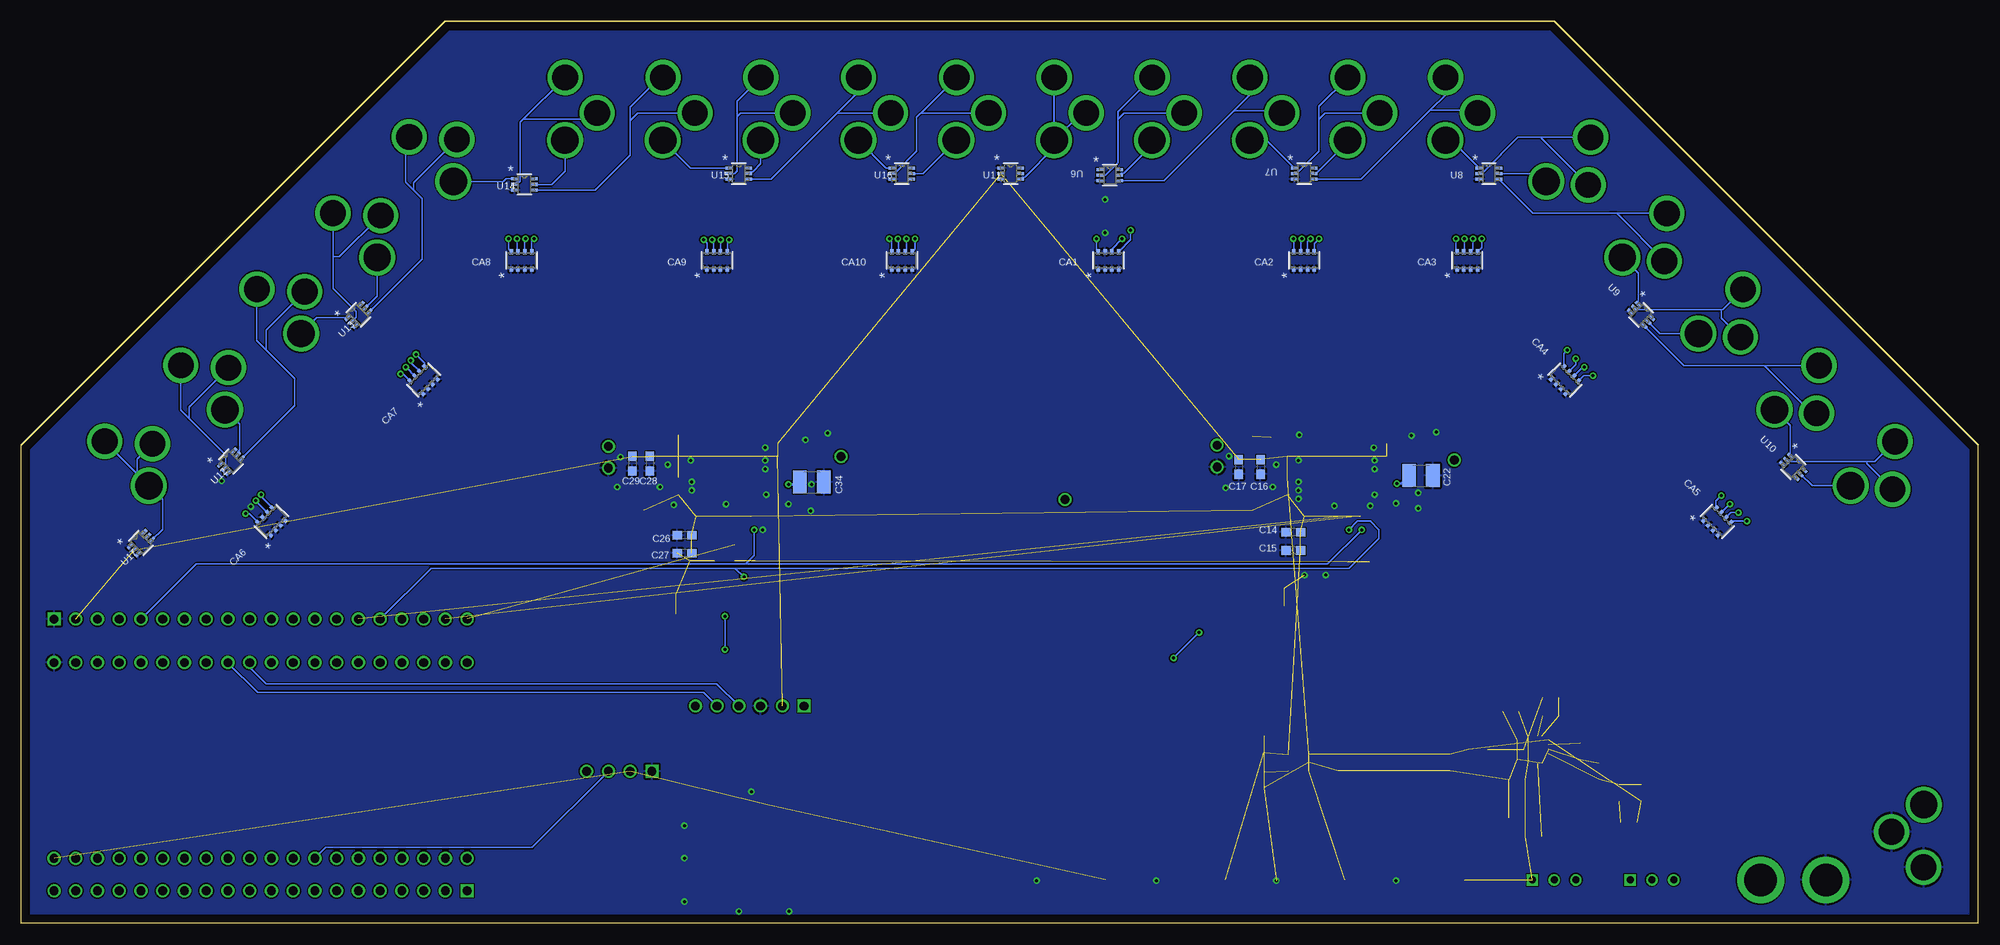
[diagram p5: board, bottom side, seen from below]

Size 228.6 x 105.41 mm. Coordinates in mm from the lower left corner, seen from the top.
Outline: 0,0 228.6,0 228.6,55.88 179.07,105.41 49.53,105.41 0,55.88 0,0
Copper layers (1*16): Top 0.035mm / dielectric 1.5mm / Bottom 0.035mm
Design rules "default": minimum track width 6mil, minimum drill 0.35mm, track to track 6mil, track to pad 6mil, pad to pad 6mil, via to via 6mil, smd to smd 6mil, copper to edge 40mil, drill to drill 6mil, minimum pad ring 10mil, minimum via ring 8mil, stop-mask expansion 4mil, vias tented up to drill 0mil, thermal gap 10mil

### Footprints (pad centres in the part's own frame; a part is rotated, then mirrored left to right if it is on the bottom)
MBED_LPC1768 = drill 1.02: D+ 11.43,1.27; D- 11.43,3.81; GND -11.43,24.13; IF+ 11.43,16.51; IF- 11.43,19.05; NR -11.43,16.51; P$5 -11.43,13.97; P$6 -11.43,11.43; P$7 -11.43,8.89; P$8 -11.43,6.35; P$9 -11.43,3.81; P$10 -11.43,1.27; P$11 -11.43,-1.27; P$12 -11.43,-3.81; P$13 -11.43,-6.35; P$14 -11.43,-8.89; P$15 -11.43,-11.43; P$16 -11.43,-13.97; P$17 -11.43,-16.51; P$18 -11.43,-19.05; P$19 -11.43,-21.59; P$20 -11.43,-24.13; P$21 11.43,-24.13; P$22 11.43,-21.59; P$23 11.43,-19.05; P$24 11.43,-16.51; P$25 11.43,-13.97; P$26 11.43,-11.43; P$27 11.43,-8.89; P$28 11.43,-6.35; P$29 11.43,-3.81; P$30 11.43,-1.27; RD+ 11.43,11.43; RD- 11.43,13.97; TD+ 11.43,6.35; TD- 11.43,8.89; VB -11.43,19.05; VIN -11.43,21.59; VOUT 11.43,24.13; VU 11.43,21.59
C0805 = smd 1.3 x 1.5: 1 -0.95,0; 2 0.95,0
C0603 = smd 1.1 x 1: 1 -0.85,0; 2 0.85,0
C1210 = smd 1.6 x 2.7: 1 -1.4,0; 2 1.4,0
CAP_CA0612_3P2X1P6_YAG = smd 0.634 x 0.408: 1 -1.009,1.2; 2 -1.009,0.4; 3 -1.009,-0.4; 4 -1.009,-1.2; 5 1.009,-1.2; 6 1.009,-0.4; 7 1.009,0.4; 8 1.009,1.2
LED0603 = smd 0.8 x 0.8: A -0.775,0; C 0.775,0
CONN_3M_2900 = smd 0.813 x 1.499: 1 -1.772,3.449; 2 -0.68,3.042; 3 0.412,3.449; 4 1.505,3.652; 5 2.597,3.449; 6 3.689,3.652; 7 4.781,3.449; 8 5.873,3.449 | smd 1.397 x 1.905: 9 -6.693,6.998; 10 6.551,6.276 | smd 1.803 x 1.397: 11 -0.775,-7.188; 12 4.94,-7.188
BANANA_CONN = drill 3.81 pad 5.461: P$1 0,0
POWER_JACK_PTH_LOCK = drill 2.997 pad 4.115: GND 0.025,6.557; GNDBREAK 3.762,10.7 | drill 3.2 pad 4.115: PWR 0,13.878
1X04 = drill 1.016 square: 1 -3.81,0 | drill 1.016: 2 -1.27,0; 3 1.27,0; 4 3.81,0
1X20 = drill 1.016 square: 1 -24.13,0 | drill 1.016: 2 -21.59,0; 3 -19.05,0; 4 -16.51,0; 5 -13.97,0; 6 -11.43,0; 7 -8.89,0; 8 -6.35,0; 9 -3.81,0; 10 -1.27,0; 11 1.27,0; 12 3.81,0; 13 6.35,0; 14 8.89,0; 15 11.43,0; 16 13.97,0; 17 16.51,0; 18 19.05,0; 19 21.59,0; 20 24.13,0
1X02 = drill 1.016: 1 -1.27,0; 2 1.27,0
1X01 = drill 1.016: 1 0,0
1X06 = drill 1.016 square: 1 -6.35,0 | drill 1.016: 2 -3.81,0; 3 -1.27,0; 4 1.27,0; 5 3.81,0; 6 6.35,0
INDC2520X100N = smd 1.24 x 2.22: 1 -1.09,0; 2 1.09,0
R0805 = smd 1.3 x 1.5: 1 -0.95,0; 2 0.95,0
BO_CAT16 = smd 0.634 x 0.459: 1 -0.933,1.372; 2 -0.933,0.457; 3 -0.933,-0.457; 4 -0.933,-1.372; 5 0.933,-1.372; 6 0.933,-0.457; 7 0.933,0.457; 8 0.933,1.372
SW_450301014042_WRE = drill 0.813 pad 1.321 square: 1 0,0 | drill 0.813 pad 1.321: 2 0,-2.54; 3 0,-5.08
PAG64_TEX = smd 1.341 x 0.279: 1 -5.776,3.75; 2 -5.776,3.25; 3 -5.776,2.75; 4 -5.776,2.25; 5 -5.776,1.75; 6 -5.776,1.25; 7 -5.776,0.75; 8 -5.776,0.25; 9 -5.776,-0.25; 10 -5.776,-0.75; 11 -5.776,-1.25; 12 -5.776,-1.75; 13 -5.776,-2.25; 14 -5.776,-2.75; 15 -5.776,-3.25; 16 -5.776,-3.75; 33 5.776,-3.75; 34 5.776,-3.25; 35 5.776,-2.75; 36 5.776,-2.25; 37 5.776,-1.75; 38 5.776,-1.25; 39 5.776,-0.75; 40 5.776,-0.25; 41 5.776,0.25; 42 5.776,0.75; 43 5.776,1.25; 44 5.776,1.75; 45 5.776,2.25; 46 5.776,2.75; 47 5.776,3.25; 48 5.776,3.75 | smd 0.279 x 1.341: 17 -3.75,-5.776; 18 -3.25,-5.776; 19 -2.75,-5.776; 20 -2.25,-5.776; 21 -1.75,-5.776; 22 -1.25,-5.776; 23 -0.75,-5.776; 24 -0.25,-5.776; 25 0.25,-5.776; 26 0.75,-5.776; 27 1.25,-5.776; 28 1.75,-5.776; 29 2.25,-5.776; 30 2.75,-5.776; 31 3.25,-5.776; 32 3.75,-5.776; 49 3.75,5.776; 50 3.25,5.776; 51 2.75,5.776; 52 2.25,5.776; 53 1.75,5.776; 54 1.25,5.776; 55 0.75,5.776; 56 0.25,5.776; 57 -0.25,5.776; 58 -0.75,5.776; 59 -1.25,5.776; 60 -1.75,5.776; 61 -2.25,5.776; 62 -2.75,5.776; 63 -3.25,5.776; 64 -3.75,5.776
VQFN-HR14_RJR_TEX = smd 0.711 x 0.406: 1 -1.85,1.15; 5 -1.85,-1.15 | smd 0.711 x 0.254: 2 -1.85,0.525; 4 -1.85,-0.525 | smd 0.711 x 0.305: 3 -1.85,0 | smd 0.254 x 0.711: 6 -1.125,-1.6; 7 -0.625,-1.6; 13 -0.625,1.6; 14 -1.125,1.6 | smd 0.406 x 0.991: 8 0.45,-1.45; 12 0.45,1.45 | smd 0.813 x 0.406: 9 1.8,-1.15; 11 1.8,1.15 | smd 2.388 x 0.406: 10 1,0
MF05A = smd 1.259 x 0.568: 1 -1.219,0.953; 2 -1.219,0; 3 -1.219,-0.953; 4 1.219,-0.953; 5 1.219,0.953
DCK6_TEX = smd 0.845 x 0.355: 1 -1.134,0.65; 2 -1.134,0; 3 -1.134,-0.65; 4 1.134,-0.65; 5 1.134,0; 6 1.134,0.65

### Placement (x,y rotation side)
A1  200.66,19.05 270 top
C1  61.72,18.8 270 top
C2  64.01,18.8 270 top
C3  66.29,18.8 270 top
C4  54.61,24.77 0 top
C5  53.85,16.76 0 top
C6  53.85,14.61 0 top
C7  53.85,12.32 0 top
C8  49.91,26.42 180 top
C9  46.48,20.07 270 top
C10  41.91,15.24 90 top
C11  74.8,18.8 270 top
C12  83.44,16.76 270 top
C13  83.44,20.95 90 top
C14  80.01,45.72 180 bottom
C15  80.01,43.58 180 bottom
C16  83.82,53.34 270 bottom
C17  86.36,53.34 270 bottom
C18  83.82,51.82 270 top
C19  86.11,51.82 270 top
C20  66.49,52.5 180 top
C21  66.8,49.53 270 top
C22  65.09,52.32 0 bottom
C23  66.6,55.04 90 top
C24  64.57,55.55 90 top
C25  84.78,57.75 270 top
C26  151.13,45.34 180 bottom
C27  151.13,43.28 180 bottom
C28  155.19,53.72 270 bottom
C29  157.23,53.72 270 bottom
C30  155.19,52.07 270 top
C31  157.23,52.07 270 top
C32  137.51,52.39 180 top
C33  137.92,49.02 270 top
C34  136.25,51.56 0 bottom
C35  138.02,54.98 90 top
C36  135.66,55.49 90 top
C37  157.21,57.65 270 top
CA1  101.6,77.47 90 bottom
CA2  78.74,77.47 90 bottom
CA3  59.69,77.47 90 bottom
CA4  48.26,63.5 45 bottom
CA5  30.48,46.99 45 bottom
CA6  199.39,46.99 135 bottom
CA7  181.61,63.5 135 bottom
CA8  170.18,77.47 90 bottom
CA9  147.32,77.47 90 bottom
CA10  125.73,77.47 90 bottom
D1  66.04,5.08 0 top
D2  80.01,5.08 0 top
D3  93.98,5.08 0 top
D4  107.95,5.08 0 top
D5  153.67,7.62 180 top
D6  153.67,11.43 180 top
D7  153.67,2.54 180 top
J1  139.7,10.16 0 top
J2  25.4,5.08 0 top
J3  17.78,5.08 0 top
J4  6.35,0 0 top
J5  96.52,105.41 180 top
J6  85.09,105.41 180 top
J7  73.66,105.41 180 top
J8  62.23,105.41 180 top
J9  40.64,96.52 225 top
J10  31.75,87.63 225 top
J11  22.86,78.74 225 top
J12  13.97,69.85 225 top
J13  214.63,69.85 135 top
J14  205.74,78.74 135 top
J15  196.85,87.63 135 top
J16  187.96,96.52 135 top
J17  165.1,105.41 180 top
J18  153.67,105.41 180 top
J19  142.24,105.41 180 top
J20  130.81,105.41 180 top
J21  107.95,105.41 180 top
J22  5.08,60.96 225 top
J23  223.52,60.96 135 top
J24  119.38,105.41 180 top
JP1  158.75,17.78 0 top
JP2  200.66,3.81 0 top
JP3  200.66,35.56 180 top
JP4  88.9,54.61 90 top
JP5  160.02,54.48 90 top
JP6  106.68,49.53 0 top
JP7  143.51,25.4 0 top
JP8  61.2,54.16 0 top
JP9  132.84,54.56 0 top
L1  58.42,20.32 0 top
R1  51.94,10.16 0 top
R2  49.91,24.26 0 top
R3  44.32,17.78 90 top
R4  39.37,15.24 90 top
R5  40.77,11.81 0 top
R6  80.07,37.1 0 top
R7  80.07,39.19 0 top
R8  60.96,5.08 0 top
R9  74.93,5.08 0 top
R10  88.9,5.08 0 top
R11  102.87,5.08 0 top
R12  82.64,57.75 270 top
R13  155.17,57.66 270 top
R14  125.73,82.55 270 top
R15  160.02,2.54 180 top
R16  160.02,7.62 180 top
R17  160.02,11.43 180 top
R18  106.68,45.72 270 top
R19  136.48,45.2 180 top
R20  78.74,43.18 270 top
R21  76.2,43.18 90 top
R22  83.82,48.26 0 top
R23  154.94,48.26 0 top
R24  151.15,38.47 0 top
R25  151.15,36.18 0 top
R26  150.46,43.28 270 top
R27  147.62,43.28 90 top
R28  156.21,54.61 0 top
R29  85.09,54.61 0 top
R30  71.12,43.18 270 top
R31  73.66,43.18 270 top
R32  145.28,43.28 270 top
R33  142.9,43.3 270 top
R45  26.67,50.8 315 top
RA1  101.6,82.55 270 top
RA2  78.74,82.55 270 top
RA3  59.69,82.55 270 top
RA4  44.45,67.31 315 top
RA5  203.2,50.8 225 top
RA6  185.42,67.31 225 top
RA7  170.18,82.55 270 top
RA8  147.32,82.55 270 top
SW1  40.64,5.08 270 top
SW2  52.07,5.08 270 top
U1  74.93,53.34 270 top
U2  146.05,53.34 270 top
U3  52.07,20.32 0 top
U5  79.38,18.8 0 top
U6  101.44,87.43 0 bottom
U7  78.74,87.63 0 bottom
U8  57.15,87.63 0 bottom
U9  39.37,71.12 315 bottom
U10  21.59,53.34 315 bottom
U11  113.03,87.63 0 bottom
U12  204.12,53.96 45 bottom
U13  189.23,71.12 45 bottom
U14  169.83,86.36 0 bottom
U15  144.78,87.63 0 bottom
U16  125.73,87.63 0 bottom
U17  214.63,44.45 45 bottom

### Tracks (layer width: path | path; a pad name or v marks a point on that pad's centre or on a via)
1N
  Top 0.152: R45.1 26.98,62.02 26,63 | J12.GND 23.8,65.2 26,63 | 26,63 22.25,63 J12.GNDBREAK
  Bottom 0.152: U9.4 34.37,65.2 25,65.2 | 25,65.2 J12.GND | 25,65.2 19.43,59.62 J12.GNDBREAK
1P
  Top 0.152: R45.2 23.78,54.33 J12.PWR
  Bottom 0.152: U10.1 21.93,58.19 J12.PWR
2N
  Top 0.152: RA4.3 37.03,74.09 33,74.09 | 33,74.09 J11.GND | 33,74.09 27.77,68.85 J11.GNDBREAK
  Bottom 0.152: U9.2 39.83,71.92 39.63,71.73 30,71.73 | 30,71.73 29.84,71.73 J11.GND | 30,71.73 30,70.75 J11.GNDBREAK
2P
  Top 0.152: RA4.4 40.89,68.93 J11.PWR
  Bottom 0.152: U9.5 37.18,68.93 J11.PWR
3.3_ANA_LED
  Top 0.152: R10.2 D3.A
3.3V_DIG_LED
  Top 0.152: R11.2 D4.A
3N
  Top 0.152: RA4.1 44.76,79.24 43,81 | J10.GND 41.02,82.98 43,81 | 43,81 40,81 36.66,77.66 J10.GNDBREAK
  Bottom 0.152: U8.4 52.01,82.98 43,82.98 42.23,82.98 | 42.23,82.98 J10.GND | J10.GNDBREAK 42.23,82.98
3P
  Top 0.152: RA4.2 41.56,70.84 J10.PWR
  Bottom 0.152: U9.1 39.71,75.97 J10.PWR
4N
  Top 0.152: RA3.3 59.23,85.77 53.13,91.87 50,91.87 | 50,91.87 J9.GND | 50,91.87 45.55,87.41 J9.GNDBREAK
  Bottom 0.152: U8.2 58.04,87.87 57.77,87.87 53.77,91.87 51,91.87 | 51,91.87 J9.GND | J9.GNDBREAK 51,91.75 51,91.87
4P
  Top 0.152: RA3.4 58.3,83.5 58.3,84.5 56.09,86.71 J9.PWR
  Bottom 0.152: U8.5 51.38,87.63 J9.PWR
5N
  Top 0.152: RA3.1 65,87.42 65,93.07 | 61,98 62,99 65,96 65,93.07 | 65,93.07 63.2,94.87 58.63,94.87 J8.GNDBREAK
  Bottom 0.152: U7.4 72.08,86.98 64.03,95.03 | 64.03,95.03 62.2,96.85 J8.GND | 64.03,95.03 58.79,95.03 J8.GNDBREAK
5P
  Top 0.152: RA3.2 60.15,89.45 J8.PWR
  Bottom 0.152: U8.1 61.54,91.53 J8.PWR
5V_LED
  Top 0.152: R9.2 D2.A
6N
  Top 0.152: RA2.3 78.28,94.2 76.24,96.24 | 76.24,96.24 J7.GND | 76.24,96.24 74.71,94.71 J7.GNDBREAK
  Bottom 0.152: U7.2 79.83,87.67 79.56,87.67 77,90.23 77,94 | J7.GND 77,95.49 77,94 | J7.GNDBREAK 76.29,94.71 77,94
6P
  Top 0.152: RA2.4 77.37,87.82 J7.PWR
  Bottom 0.152: J7.PWR 73.66,91.3 77.33,87.63 U7.5
7N
  Top 0.152: RA2.1 80,83.59 80,84 84,88 86,88 89,91 89,95 88,96 | 88,96 85.15,98.85 J6.GND | 88,96 86.71,94.71 J6.GNDBREAK
  Bottom 0.152: U6.4 95.14,86.78 86.96,94.96 | 86.96,94.96 85.06,96.85 J6.GND | 86.96,94.96 81.58,94.96 J6.GNDBREAK
7P
  Top 0.152: RA2.2 79.2,85.64 J6.PWR
  Bottom 0.152: U7.1 83.13,91.53 J6.PWR
8N
  Top 0.152: RA1.3 101.14,94.2 100.67,94.67 | 100.67,94.67 J5.GND | 100.67,94.67 92.8,94.67 J5.GNDBREAK
  Bottom 0.152: U6.2 101.97,87.43 100.5,88.9 100.5,94 | J5.GND 100.5,94.85 100.5,94 | J5.GNDBREAK 99.79,94.71 100.5,94
8P
  Top 0.152: RA1.4 96.52,87.19 J5.PWR
  Bottom 0.152: U6.5 100.06,87.67 99.79,87.67 96.52,90.94 J5.PWR
9N
  Top 0.152: R14.1 134.6,90.98 134.6,94 | J20.GND 134.6,95.04 134.6,94 | 134.6,94 133.89,94.71 J20.GNDBREAK
  Bottom 0.152: U15.4 143.63,87 141,87 134,94 133.29,94.71 | 133.29,94.71 130.78,97.22 J20.GND | J20.GNDBREAK 133.29,94.71
9P
  Top 0.152: R14.2 126.19,86.91 J20.PWR
  Bottom 0.152: U16.1 127.56,88.28 J20.PWR
9V_LED
  Top 0.152: R8.2 D1.A
10N
  Top 0.152: RA8.3 146.86,94.2 145.53,95.53 | 145.53,95.53 J19.GND | 145.53,95.53 139.3,95.53 J19.GNDBREAK
  Bottom 0.152: U15.2 145.27,87.63 145,87.9 145,94.3 | J19.GND 145,96.07 145,94.3 | J19.GNDBREAK 144.59,94.71 145,94.3
10P
  Top 0.152: RA8.4 145.95,87.82 J19.PWR
  Bottom 0.152: U15.5 143.4,87.87 143.13,87.87 142.24,88.76 J19.PWR
11N
  Top 0.152: RA8.1 152.21,87 155,87 157,89 157,95 | 157,95 157,96 154.15,98.85 J18.GND | 157,95 156.71,94.71 J18.GNDBREAK
  Bottom 0.152: U14.4 168.69,85.7 161.6,85.7 157.5,89.8 157.5,93.8 | 157.5,93.8 157.5,95.4 154.05,98.85 J18.GND | J18.GNDBREAK 156.59,94.71 157.5,93.8
11P
  Top 0.152: RA8.2 147.78,85.64 J18.PWR
  Bottom 0.152: U15.1 150.42,88.28 J18.PWR
12N
  Top 0.152: RA7.3 169.72,93 | 169.72,93 169.72,94.2 J17.GND | 169.72,93 168.01,94.71 J17.GNDBREAK
  Bottom 0.152: U14.2 170.72,86.6 170.45,86.6 170.31,86.74 170.31,93.61 169.96,93.96 | 169.96,93.96 J17.GND | J17.GNDBREAK 162.09,93.96 169.96,93.96
12P
  Top 0.152: RA7.4 168.81,87.82 J17.PWR
  Bottom 0.152: U14.5 166.64,86.36 165.1,87.9 J17.PWR
13N
  Top 0.152: RA7.1 171.55,84.05 171.7,84.2 180.8,84.2 183.31,86.71 183.31,88 | 183.31,88 J16.GND | 183.31,88 179.69,91.61 J16.GNDBREAK
  Bottom 0.152: U13.4 181.8,77.63 181.8,84.7 182.8,85.7 | 182.8,85.7 183.7,86.6 183.7,91.51 J16.GND | J16.GNDBREAK 182.8,86.55 182.8,85.7
13P
  Top 0.152: RA7.2 170.64,86.64 172,88 176.85,88 J16.PWR
  Bottom 0.152: U14.1 171.99,87.01 172.29,86.71 J16.PWR
14N
  Top 0.152: RA6.3 191.23,73.77 | 191.23,73.77 192.2,74.73 J15.GND | 191.23,73.77 191.23,78.12 J15.GNDBREAK
  Bottom 0.152: U13.2 189.5,70.85 189.5,71.5 192.2,74.2 192.2,77.9 | 192.2,77.9 J15.GND | J15.GNDBREAK 191.45,77.9 192.2,77.9
14P
  Top 0.152: RA6.4 187.04,70.87 J15.PWR
  Bottom 0.152: J15.PWR 187.04,73.31 U13.5
15N
  Top 0.152: RA6.1 188,67.95 188,68 191.7,68 194.4,65.3 197.8,65.3 201.09,68.59 201.09,70 | 201.09,70 J14.GND | 201.09,70 197.25,73.83 J14.GNDBREAK
  Bottom 0.152: U12.4 196.66,60.49 196.66,63.66 200,67 | J14.GND 201.09,68.09 200,67 | J14.GNDBREAK 200,69.35 200,67
15P
  Top 0.152: RA6.2 187.68,68.93 J14.PWR
  Bottom 0.152: U13.1 194.08,70.78 J14.PWR
16N
  Top 0.152: RA5.3 209.38,57.62 | 209.38,57.62 209.98,58.22 J13.GND | 209.38,57.62 209.38,59.97 J13.GNDBREAK
  Bottom 0.152: U12.2 204.87,53.16 204.73,53.3 204.73,54.73 209,59 | J13.GND 209.98,59.98 209,59 | J13.GNDBREAK 209,60.35 209,59
16P
  Top 0.152: RA5.4 204.82,54.36 J13.PWR
  Bottom 0.152: U12.5 203.32,55.11 203.12,55.3 203.12,58.34 J13.PWR
!CS!_ADS_0  (1 unrouted)
  Top 0.152: A1.P$15 JP3.15 | U1.39 74.18,44.65 R31.1
!CS!_ADS_1  (1 unrouted)
  Top 0.152: A1.P$20 JP3.20 | U2.39 145.3,46.4 144.6,45.7 144.6,44.91 R32.1
!CS!_SD
  Top 0.152: JP3.14 A1.P$14 191.77,27.77 187,23 148.03,23 139.48,14.45 139.48,13.66 J1.2
!INT!_ADS  (via drill 0.35)
  Top 0.152: A1.P$8 JP3.8 203.57,39 171,39 163,31 v94,31 | U1.47 78.31,47.43 78.31,46.8 91,34.11 v91,34
  Bottom 0.152: v91,34 v94,31
!RESET!_ADS_0  (1 unrouted)
  Top 0.152: A1.P$19 JP3.19 | U1.36 72.68,45.69 R30.1
!RESET!_ADS_1
  Top 0.152: U2.36 143.8,45.15 R33.1
+3.3-REG  (3 unrouted)
+3.3V-MBED  (3 unrouted)
  Top 0.152: A1.VOUT JP2.20
+3.3V-REG  (14 unrouted)
+5V  (30 unrouted)
  Top 0.152: A1.VIN JP3.2
+9V  (8 unrouted)
+9V-CON
  Top 0.813: J4.PWR 26.76,13.88 SW1.3
+9V_BATT
  Top 0.813: J2.P$1 28.48,2 35.02,2 SW1.2
AIN1N  (via drill 0.35)
  Top 0.152: U1.15 71.68,59.75 70.43,61 61,61 50,50 v30,50 29.41,50 R45.8
  Bottom 0.152: v30,50 30.61,49.38 CA5.8
AIN1P  (via drill 0.35)
  Top 0.152: U1.16 71.18,59.63 70.21,60.6 61.6,60.6 50,49 v29,49 29,49.12 R45.7
  Bottom 0.152: v29,49 29.04,49 CA5.7
AIN2N  (via drill 0.35)
  Top 0.152: U1.13 72.68,61.32 69,65 v46,65 44.79,66.21 RA4.6
  Bottom 0.152: v46,65 46.19,65 CA4.6
AIN2P  (via drill 0.35)
  Top 0.152: U1.14 72.15,59.15 72.15,60.78 68.93,64 v45,64 44.14,64.86 RA4.5
  Bottom 0.152: v45,64 46.06,64 CA4.5
AIN3N  (via drill 0.35)
  Top 0.152: U1.11 73.68,62.32 69,67 v48,67 46.7,67 RA4.8
  Bottom 0.152: v48,67 48.4,66.61 CA4.8
AIN3P  (via drill 0.35)
  Top 0.152: U1.12 73.18,61.82 69,66 v47,66 46.41,66 RA4.7
  Bottom 0.152: v47,66 47,65.3 47.8,64.5 CA4.7
AIN4N  (via drill 0.35)
  Top 0.152: U1.9 74.68,64.32 v59,80 59,81.38 RA3.6
  Bottom 0.152: v59,80 59,78.77 CA3.6
AIN4P  (via drill 0.35)
  Top 0.152: U1.10 74.18,63.82 v58,80 58,81.3 RA3.5
  Bottom 0.152: v58,80 58,78.97 CA3.5
AIN5N  (via drill 0.35)
  Top 0.152: U1.7 75.68,65.32 v61,80 61,81.56 RA3.8
  Bottom 0.152: v61,80 61,78.59 CA3.8
AIN5P  (via drill 0.35)
  Top 0.152: U1.8 75.18,64.82 v60,80 60,81.47 RA3.7
  Bottom 0.152: v60,80 60,78.57 CA3.7
AIN6N  (via drill 0.35)
  Top 0.152: U1.5 76.68,60.68 78,62 v78,80 78,81.33 RA2.6
  Bottom 0.152: v78,80 78.34,79.66 CA2.6
AIN6P  (via drill 0.35)
  Top 0.152: U1.6 76.18,60.61 77,61.43 v77,80 77,81.25 RA2.5
  Bottom 0.152: v77,80 77.54,79.46 CA2.5
AIN7N  (via drill 0.35)
  Top 0.152: U1.3 77.68,60.68 80,63 v80,80 80,81.5 RA2.8
  Bottom 0.152: CA2.8 79.94,79.94 v80,80
AIN7P  (via drill 0.35)
  Top 0.152: RA2.7 79.2,80.2 v79,80 79,62.43 77.18,60.61 U1.4
  Bottom 0.152: v79,80 79.14,79.86 CA2.7
AIN8N  (via drill 0.35)
  Top 0.152: U1.1 78.68,60.68 98,80 v100,80 101.14,81.14 RA1.6
  Bottom 0.152: v100,80 101.2,78.8 CA1.6
AIN8P  (via drill 0.35)
  Top 0.152: U1.2 78.18,60.61 98.57,81 v99,81 99.61,81 RA1.5
  Bottom 0.152: CA1.5 99,79.88 v99,81
AIN9N  (via drill 0.35)
  Top 0.152: U2.15 142.8,60.4 127.2,76 v127.2,80 127.2,81.52 R14.8
  Bottom 0.152: CA10.8 126.93,79.73 v127.2,80
AIN9P  (via drill 0.35)
  Top 0.152: U2.16 142.3,60.3 126.2,76.4 v126.2,80 126.2,81.6 R14.7
  Bottom 0.152: CA10.7 126.13,79.93 v126.2,80
AIN10N  (via drill 0.35)
  Top 0.152: U2.13 143.8,76.8 v146.9,79.9 146.9,81.58 RA8.6
  Bottom 0.152: CA9.6 146.92,79.88 v146.9,79.9
AIN10P  (via drill 0.35)
  Top 0.152: U2.14 143.3,77.3 v145.9,79.9 145.9,81.57 RA8.5
  Bottom 0.152: CA9.5 146.12,79.68 v145.9,79.9
AIN11N  (via drill 0.35)
  Top 0.152: RA8.8 148.9,81.41 148.9,80 | 148.9,80 v148.9,79.9 | U2.11 144.8,75.9 148.9,80
  Bottom 0.152: CA9.8 148.52,79.52 v148.9,79.9
AIN11P  (via drill 0.35)
  Top 0.152: RA8.7 147.9,81.49 147.9,80 | 147.9,80 v147.9,79.9 | U2.12 144.3,76.4 147.9,80
  Bottom 0.152: CA9.7 147.72,79.72 v147.9,79.9
AIN12N  (via drill 0.35)
  Top 0.152: U2.9 145.8,61.7 162.1,78 167.7,78 v169.7,80 169.72,80.02 RA7.6
  Bottom 0.152: CA8.6 169.78,79.92 v169.7,80
AIN12P  (via drill 0.35)
  Top 0.152: U2.10 145.3,68.3 157,80 v168.7,80 168.81,80.11 RA7.5
  Bottom 0.152: CA8.5 168.98,79.72 v168.7,80
AIN13N  (via drill 0.35)
  Top 0.152: U2.7 146.93,59.25 146.93,59.88 163.75,76.69 168.25,76.69 171.56,80 v171.7,80 171.7,81.47 RA7.8
  Bottom 0.152: CA8.8 171.7,78.8 v171.7,80
AIN13P  (via drill 0.35)
  Top 0.152: U2.8 146.43,59.25 146.43,59.88 163.55,77 167.7,77 v170.7,80 170.7,81.55 RA7.7
  Bottom 0.152: CA8.7 170.7,78.6 v170.7,80
AIN14N  (via drill 0.35)
  Top 0.152: RA6.6 183.26,65.8 v183.1,65.8 153.85,65.8 147.93,59.88 147.93,59.25 U2.5
  Bottom 0.152: CA7.6 183.1,65.56 v183.1,65.8
AIN14P  (via drill 0.35)
  Top 0.152: U2.6 147.43,59.25 147.43,59.88 157.55,70 179,70 v182.5,66.5 182.67,66.5 RA6.5
  Bottom 0.152: CA7.5 181.47,65.47 v182.5,66.5
AIN15N  (via drill 0.35)
  Top 0.152: RA6.8 184.3,64.25 v184.3,64.2 184.1,64 153.05,64 148.93,59.88 148.93,59.25 U2.3
  Bottom 0.152: CA7.8 184.01,64.2 v184.3,64.2
AIN15P  (via drill 0.35)
  Top 0.152: RA6.7 183.76,65 v183.7,65 153.55,65 148.43,59.88 148.43,59.25 U2.4
  Bottom 0.152: CA7.7 183.68,65 v183.7,65
AIN16N  (via drill 0.35)
  Top 0.152: U2.1 149.8,59.62 152.18,62 185,62 197.6,49.4 v201.2,49.4 202.22,50.42 RA5.6
  Bottom 0.152: CA6.6 201.2,49.37 v201.2,49.4
AIN16P  (via drill 0.35)
  Top 0.152: U2.2 149.43,59.25 149.43,59.88 152.55,63 187.7,63 v200.6,50.1 201.57,51.07 RA5.5
  Bottom 0.152: CA6.5 200.6,49.9 v200.6,50.1
B1
  Top 0.152: A1.VB JP3.3
B2
  Top 0.152: A1.NR JP3.4
B5
  Top 0.152: A1.P$21 JP2.1
B6
  Top 0.152: A1.P$23 JP2.3
B7
  Top 0.152: A1.P$24 JP2.4
B8
  Top 0.152: A1.P$26 JP2.6
B9
  Top 0.152: A1.P$30 JP2.10
B10
  Top 0.152: A1.D+ JP2.11
B11
  Top 0.152: A1.D- JP2.12
B12
  Top 0.152: A1.TD+ JP2.13
B13
  Top 0.152: A1.TD- JP2.14
B14
  Top 0.152: A1.RD+ JP2.15
B15
  Top 0.152: A1.RD- JP2.16
B16
  Top 0.152: A1.IF+ JP2.17
B17
  Top 0.152: A1.IF- JP2.18
B18
  Top 0.152: A1.VU JP2.19
BATT_SWITCH
  Top 0.813: SW1.1 SW2.3
BIAS
  Top 0.152: RA1.1 102.97,86.55 J21.PWR 107.95,95 | 107.95,95 107.95,98.83 J21.GND | 107.95,95 107.66,94.71 J21.GNDBREAK
  Bottom 0.152: U11.4 111.65,87.22 111.38,87.22 107.95,90.65 J21.PWR | J21.PWR 107.95,98.83 J21.GND | J21.PWR 104.77,94.71 J21.GNDBREAK
BIAS1_IN
  Top 0.152: U2.63 151.94,56.71 155,56.71 | 155,56.71 R13.2 155.27,56.8 C37.2 | U2.62 154.38,56.09 155,56.71
BIAS_1
  Top 0.152: RA5.1 213.05,50.49 J23.PWR 216.28,53.72 | 216.28,53.72 218.87,56.31 J23.GND | J23.GNDBREAK 215.63,53.72 216.28,53.72
  Bottom 0.152: U17.4 212.1,46.06 212.1,49.54 J23.PWR 215.08,52.52 | 215.08,52.52 218.87,56.31 J23.GND | J23.GNDBREAK 215.08,54.27 215.08,52.52
BIAS_DRV  (via drill 0.35)
  Top 0.152: R12.1 82.74,58.6 C25.1 103,76.82 v103,80 102.97,80.03 RA1.8
  Bottom 0.152: v103,80 103,78.68 CA1.8
BIAS_DRV_1  (via drill 0.35)
  Top 0.152: RA5.8 203.51,49.01 v202.4,47.9 193.1,47.9 182.5,58.5 C37.1 157.1,58.61 R13.1
  Bottom 0.152: CA6.8 202,47.9 v202.4,47.9
BIAS_IN  (1 unrouted)
  Top 0.152: U1.62 81.11,56.09 81.2,56.19 82.03,56.19 82.42,56.58 | 82.42,56.58 R12.2 | U1.63 82.41,56.59 82.42,56.58
BIAS_INV
  Top 0.152: U1.61 80.74,55.62 81.37,55.62 81.63,55.88 JP4.2
BIAS_INV_1
  Top 0.152: U2.61 159.86,55.59 JP5.2
BIAS_REF
  Top 0.152: U1.60 83.66,55.09 R29.1
BIAS_REF_1
  Top 0.152: U2.60 154.78,55.09 R28.1
BLE_EN
  Top 0.152: JP3.17 A1.P$17 177.67,24 138.56,24 JP7.1
BLE_RX
  Top 0.152: A1.P$9 JP3.9
  Bottom 0.152: JP7.5 148.92,27 201,27 A1.P$9
BLE_STATE
  Top 0.152: JP3.18 A1.P$18 176.53,25.4 JP7.6
BLE_TX
  Top 0.152: A1.P$10 JP3.10
  Bottom 0.152: A1.P$10 201.93,29.93 200,28 147.38,28 JP7.4
BYPASS  (1 unrouted)
CBOOT  (2 unrouted)
CLK
  Top 0.152: U2.37 144.37,47.63 144.37,48.43 143.33,49.46 141.69,49.46 R19.1
CLK_ADS
  Top 0.152: U1.37 73.18,48.78 73.9,49.5 78.5,49.5 83.23,44.77 R18.2
  Top 0.305: R19.2 135.1,44.77 R18.2
CLK_HDR
  Top 0.152: R18.1 JP6.1
CLKSEL_0
  Top 0.152: U1.52 80.74,51.06 81.37,51.06 82.87,49.56 R22.1
CLKSEL_1
  Top 0.152: U2.52 151.84,51.07 152.48,51.07 153.99,49.56 R23.1
DEBUG_1
  Top 0.152: A1.P$29 JP2.9 194.13,1.09 162.42,1.09 R15.1
DEBUG_2
  Top 0.152: A1.P$25 JP2.5 184.28,1.4 167.64,1.4 161.42,7.62 R16.1
DEBUG_3
  Top 0.152: A1.P$22 JP2.2 176.96,1.7 170.7,1.7 R17.1
EN  (1 unrouted)
FB  (3 unrouted)
FB_CAP  (1 unrouted)
GND  (via drill 0.35)  (24 unrouted)
  Top 0.152: A1.GND JP3.1 | D6.C v151.13,11.43 | D5.C v151.13,7.62 | D7.C v151.13,2.54 | J1.11 138.81,2.86 | R29.2 v87.49,54.61 v87.5,54.6 | RA5.7 201.8,48.75 v201.8,48.7 | v205.2,51.7 204.64,51.14 RA5.2 | R28.2 158.49,54.61 v158.6,54.5
  Top 0.305: J1.12 144.78,2.83 v144.78,1.4 | J1.11 138.93,1.41 v138.91,1.4 | J1.6 143.3,13.9 v143.3,15.4 | C24.2 64.2,56.49 v63.3,57.4 | C23.2 66.6,56.6 v66.2,57 | U1.23 v70.49,54.09 v70.5,54.1 | U1.20 v70.6,55.6 | U1.25 v70.49,53.09 v70.5,53.1 | U1.31 v70.49,50.09 v70.5,50.1 | C21.2 66.62,48.5 v65.4,48.5 | v68,49.1 68.03,49.07 68.55,49.59 U1.32 | C18.2 82.43,50.97 v82.4,51 | C19.2 87.83,50.97 v87.9,50.9 | v79.4,54.1 80.7,54.1 U1.58 | v82,53.6 U1.57 | U1.53 v79.41,51.59 v79.4,51.6 | U1.64 v79.31,57.09 v79.3,57.1 | RA1.7 102.06,80.76 v102,80.7 | v79.4,50.6 79.43,50.63 80.66,50.63 U1.51 | U1.49 v79.41,49.59 v79.4,49.6 | R21.1 v76.2,40.7 | R20.2 78.74,40.74 v78.7,40.7 | C20.2 65.64,50.54 v65.4,50.3 | U1.33 71.2,47.58 71.2,48.6 v71,48.8 | U1.41 75.18,48.78 v75.2,48.8 | U2.33 142.3,46.3 v142,46 | U2.53 v150.31,51.59 v150.3,51.6 | U2.51 v150.31,50.59 v150.3,50.6 | U2.49 152.4,49.02 v152.4,48.9 | U2.58 v150.41,54.09 v150.4,54.1 | U2.57 v153.1,53.6 | C31.2 158.78,51.22 v159,51 | C30.2 154.97,51 v154,51 | U2.41 v146.3,49 | U2.32 139.59,49.59 v139,49 | C33.2 136.43,48.17 v136.4,48.2 | U2.31 v141.59,50.09 v141.6,50.1 | C32.2 136.3,52.02 v136.3,51.3 | U2.25 v141.69,53.09 v141.7,53.1 | U2.23 v141.69,54.09 v141.7,54.1 | C35.2 137.35,56.5 v137,56.5 | C36.2 134.8,57.3 v134.4,57.3 | U2.20 140.28,55.6 v141.7,55.6 | D4.C 109.92,5.08 v110,5 | D3.C 95.92,5.08 v96,5 | D2.C 81.92,5.08 v82,5 | D1.C 67.92,5.08 v68,5 | RA1.2 102,83.54 v102,84.6
  pour Bottom: 0,0 0,56 6,62 49,105 51,105 179,105 206,78 228.3,55.7 228.3,34.9 228.3,0.3 228,0
LED-1
  Top 0.152: R15.2 D7.A
LED_2
  Top 0.152: R16.2 D5.A
LED_3
  Top 0.152: R17.2 D6.A
MISO_ADS
  Top 0.152: A1.P$6 JP3.6 206.65,41 170,41 163,34 150,34 | U1.43 76.18,48.58 76.4,48.8 78.7,48.8 93.5,34 150,34 | U2.43 147.3,46.44 148.7,45.04 148.7,35.3 150,34
MISO_SD
  Top 0.152: JP3.12 A1.P$12 187.37,21 155,21 149,15 145,15 144.48,14.48 J1.7
MOSI_ADS  (via drill 0.35)
  Top 0.152: A1.P$5 JP3.5 | U1.34 71.68,46.32 v72,46 | U2.34 142.8,46.2 v143,46
  Bottom 0.152: JP3.5 208.19,42 144,42 | v72,46 76,42 144,42 | v143,46 143,43 144,42
MOSI_SD
  Top 0.152: JP3.11 A1.P$11 199.39,30.39 189.5,20.5 155.1,20.5 146.9,12.3 140.7,12.3 140.11,12.89 J1.3
N$1
  Top 0.152: U1.42 75.61,47.5 75.61,44.7 76.18,44.13 R21.2
N$2
  Top 0.152: U1.45 77.18,45.76 77.7,45.24 77.7,40.4 78.91,39.19 R7.1
N$3
  Top 0.152: U1.44 76.78,47.46 76.78,45.67 77.38,45.08 77.38,39.14 79.12,37.4 R6.1
N$4
  Top 0.152: U1.46 77.71,47.53 77.71,45.7 78.74,44.67 R20.1
N$5
  Top 0.152: U2.45 148.3,46.3 149.4,45.2 149.4,38.9 149.83,38.47 R24.1
N$6
  Top 0.152: U2.44 147.83,47.53 147.83,46.34 149.09,45.07 149.09,37.29 R25.1
N$7
  Top 0.152: U2.46 148.93,47.43 148.93,46.8 150.46,45.27 R26.1
N$8
  Top 0.152: U2.42 146.8,45.05 R27.2
RBOOT  (1 unrouted)
SCK_SD
  Top 0.152: JP3.13 A1.P$13 194.31,29.31 187,22 149,22 142.3,15.3 J1.5
SCL_IMU
  Top 0.152: JP2.7 A1.P$27 191.77,8.89 190.5,10.16 170.18,10.16 JP1.4
SCLK_ADS  (via drill 0.35)
  Top 0.152: A1.P$7 JP3.7 205.11,40 171,40 164,33 148,33 147.4,33 | U1.40 74.7,47.54 74.7,39.4 81.1,33 147.4,33 | U2.40 145.8,46.2 146.4,45.6 v146.4,35.9 | v146.4,32 147.4,33
  Bottom 0.152: v146.4,35.9 v146.4,32
SDA_IMU
  Top 0.152: A1.P$28 JP2.8
  Bottom 0.152: A1.P$28 193.04,8.89 168.91,8.89 JP1.3
SRB1  (via drill 0.35)
  Top 0.152: R45.5 26.36,47.64 v27,47 68.26,47 71.21,49.95 71.21,55.85 70,57.06 69.19,57.06 U1.17
  Bottom 0.152: v27,47 28.77,47 CA5.5
SRB1_1  (via drill 0.35)
  Top 0.152: U2.17 139.11,57.09 124.2,72 v124.2,80 124.2,81.46 R14.5
  Bottom 0.152: CA10.5 124.2,78.81 v124.2,80
SRB1_OUT
  Top 0.152: R45.4 15.55,50.49 J22.PWR
  Bottom 0.152: U10.5 19.4,51.15 J22.PWR
SRB1_OUT_1
  Top 0.152: R14.4 119.38,88.46 J24.PWR
  Bottom 0.152: U16.5 123.28,87.63 J24.PWR
SRB2  (via drill 0.35)
  Top 0.152: U1.18 69.02,56.72 68.39,56.72 67.1,58.01 63.05,58.01 63.04,58 61,58 51,48 v28,48 27.01,48.99 R45.6
  Bottom 0.152: v28,48 28.9,48 CA5.6
SRB2_1  (via drill 0.35)
  Top 0.152: U2.18 141.19,56.59 141.4,56.8 141.4,57.9 125.2,74.1 v125.2,80 125.2,81.54 R14.6
  Bottom 0.152: CA10.6 125.2,78.61 v125.2,80
SRB2_OUT
  Top 0.152: R45.3 20.52,56.31 15.56,56.31 | 15.56,56.31 J22.GND | 15.56,56.31 J22.GNDBREAK
  Bottom 0.152: U10.2 22.05,54.14 21.85,53.95 13,53.95 | 13,53.95 12.06,53.95 J22.GND | J22.GNDBREAK 13,53.75 13,53.95
SRB2_OUT_1
  Top 0.152: R14.3 125.27,87.47 125.3,87.5 125.3,92.91 123.1,95.1 | 123.1,95.1 J24.GND | 123.1,95.1 122.71,94.71 J24.GNDBREAK
  Bottom 0.152: U16.2 126.62,87.87 126.35,87.87 124,90.22 124,94.21 123.6,94.6 123.5,94.71 | 123.5,94.71 J24.GND | J24.GNDBREAK 123.5,94.71
START_ADS  (via drill 0.35)
  Top 0.152: A1.P$16 JP3.16 | U1.38 73.68,46.18 v73.5,46 | U2.38 144.8,46.4 144.2,45.8 v144.2,40.5
  Bottom 0.152: v73.5,46 72.5,47 71,47 70,46 70,45 73.5,41.5 145.2,41.5 | JP3.16 180.75,41.5 145.2,41.5 | v144.2,40.5 145.2,41.5
SW  (2 unrouted)
VCAP1  (via drill 0.35)
  Top 0.305: v67.9,51.4 68.09,51.59 U1.28
  Bottom 0.305: 66.58,52.32 C22.1 67.41,51.4 v67.9,51.4
VCAP1_1  (via drill 0.35)
  Top 0.305: U2.28 139.29,51.59 v139,51.3
  Bottom 0.305: v139,51.3 137.91,51.3 C34.1
VCAP2
  Top 0.305: U1.30 67.01,50.59 C21.1
VCAP2_1
  Top 0.305: U2.30 138.64,50.59 C33.1
VCAP3
  Top 0.152: 83.74,52.59 C18.1
  Top 0.305: U1.55 83.74,52.59 | C18.1 C19.1
VCAP3_1
  Top 0.305: U2.55 154.86,52.59 C30.1 C31.1
VCAP4
  Top 0.305: U1.26 67.44,52.59 C20.1
VCAP6
  Top 0.305: U2.26 138.56,52.59 C32.1
VCC_CHIP  (1 unrouted)
VREFP
  Top 0.305: JP8.1 64.13,54.16 C24.1 64.98,54.19 C23.1 67.82,54.19 68.46,53.55 69.11,53.55 U1.24
VREFP_1
  Top 0.305: U2.24 139.51,53.59 138.99,54.11 138.99,54.13 C35.1 136.07,54.13 C36.1 132.86,54.54 JP9.1